# EAGLE design CM4-Interposer (EAGLE 9.6.2)

## Sheet 1 of 2
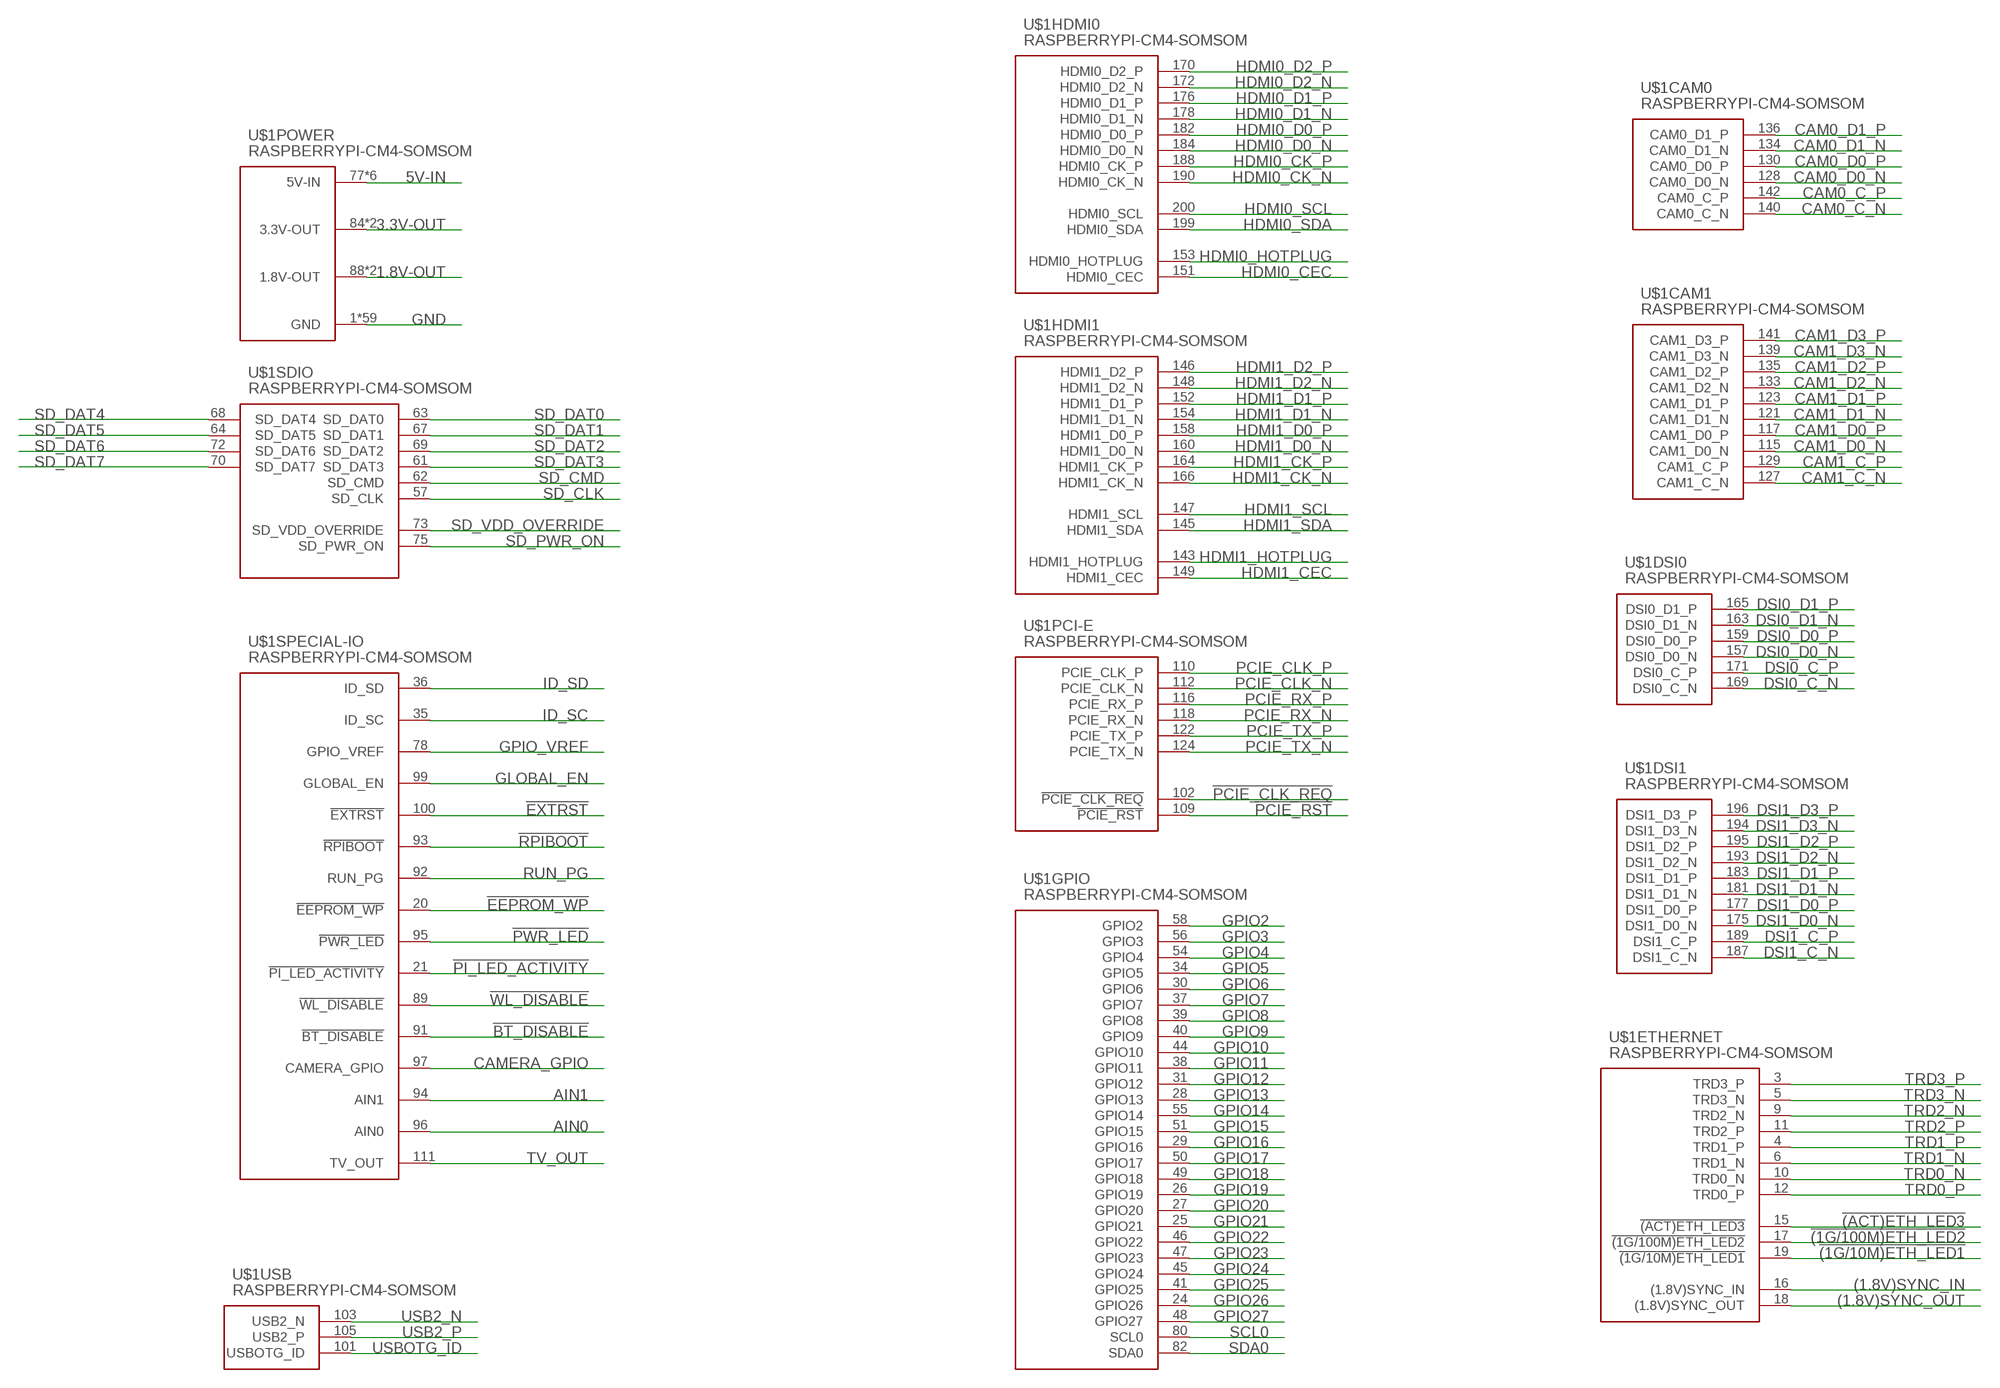
[diagram p0: schematic, sheet 1]

### Parts
U$1  RASPBERRYPI-CM4-SOMSOM  [RASPBERRYPI-CM4-PLUG]

### Nets
1.8V-OUT: U$1.88(POWER:1.8V-OUT) U$1.90(POWER:1.8V-OUT) ; also sheet 2
3.3V-OUT: U$1.84(POWER:3.3V-OUT) U$1.86(POWER:3.3V-OUT) ; also sheet 2
5V-IN: U$1.77(POWER:5V-IN) U$1.79(POWER:5V-IN) U$1.81(POWER:5V-IN) U$1.83(POWER:5V-IN) U$1.85(POWER:5V-IN) U$1.87(POWER:5V-IN) ; also sheet 2
!(1G/10M)ETH_LED1: U$1.19(ETHERNET:!(1G/10M)ETH_LED1) ; also sheet 2
!(1G/100M)ETH_LED2: U$1.17(ETHERNET:!(1G/100M)ETH_LED2) ; also sheet 2
!(ACT)ETH_LED3: U$1.15(ETHERNET:!(ACT)ETH_LED3) ; also sheet 2
!BT_DISABLE: U$1.91(SPECIAL-IO:!BT_DISABLE) ; also sheet 2
!EEPROM_WP: U$1.20(SPECIAL-IO:!EEPROM_WP) ; also sheet 2
!EXTRST: U$1.100(SPECIAL-IO:!EXTRST) ; also sheet 2
!PCIE_CLK_REQ: U$1.102(PCI-E:!PCIE_CLK_REQ) ; also sheet 2
!PCIE_RST: U$1.109(PCI-E:!PCIE_RST) ; also sheet 2
!PI_LED_ACTIVITY: U$1.21(SPECIAL-IO:!PI_LED_ACTIVITY) ; also sheet 2
!PWR_LED: U$1.95(SPECIAL-IO:!PWR_LED) ; also sheet 2
!RPIBOOT: U$1.93(SPECIAL-IO:!RPIBOOT) ; also sheet 2
!WL_DISABLE: U$1.89(SPECIAL-IO:!WL_DISABLE) ; also sheet 2
(1.8V)SYNC_IN: U$1.16(ETHERNET:(1.8V)SYNC_IN) ; also sheet 2
(1.8V)SYNC_OUT: U$1.18(ETHERNET:(1.8V)SYNC_OUT) ; also sheet 2
AIN0: U$1.96(SPECIAL-IO:AIN0) ; also sheet 2
AIN1: U$1.94(SPECIAL-IO:AIN1) ; also sheet 2
CAM0_C_N: U$1.140(CAM0:CAM0_C_N) ; also sheet 2
CAM0_C_P: U$1.142(CAM0:CAM0_C_P) ; also sheet 2
CAM0_D0_N: U$1.128(CAM0:CAM0_D0_N) ; also sheet 2
CAM0_D0_P: U$1.130(CAM0:CAM0_D0_P) ; also sheet 2
CAM0_D1_N: U$1.134(CAM0:CAM0_D1_N) ; also sheet 2
CAM0_D1_P: U$1.136(CAM0:CAM0_D1_P) ; also sheet 2
CAM1_C_N: U$1.127(CAM1:CAM1_C_N) ; also sheet 2
CAM1_C_P: U$1.129(CAM1:CAM1_C_P) ; also sheet 2
CAM1_D0_N: U$1.115(CAM1:CAM1_D0_N) ; also sheet 2
CAM1_D0_P: U$1.117(CAM1:CAM1_D0_P) ; also sheet 2
CAM1_D1_N: U$1.121(CAM1:CAM1_D1_N) ; also sheet 2
CAM1_D1_P: U$1.123(CAM1:CAM1_D1_P) ; also sheet 2
CAM1_D2_N: U$1.133(CAM1:CAM1_D2_N) ; also sheet 2
CAM1_D2_P: U$1.135(CAM1:CAM1_D2_P) ; also sheet 2
CAM1_D3_N: U$1.139(CAM1:CAM1_D3_N) ; also sheet 2
CAM1_D3_P: U$1.141(CAM1:CAM1_D3_P) ; also sheet 2
CAMERA_GPIO: U$1.97(SPECIAL-IO:CAMERA_GPIO) ; also sheet 2
DSI0_C_N: U$1.169(DSI0:DSI0_C_N) ; also sheet 2
DSI0_C_P: U$1.171(DSI0:DSI0_C_P) ; also sheet 2
DSI0_D0_N: U$1.157(DSI0:DSI0_D0_N) ; also sheet 2
DSI0_D0_P: U$1.159(DSI0:DSI0_D0_P) ; also sheet 2
DSI0_D1_N: U$1.163(DSI0:DSI0_D1_N) ; also sheet 2
DSI0_D1_P: U$1.165(DSI0:DSI0_D1_P) ; also sheet 2
DSI1_C_N: U$1.187(DSI1:DSI1_C_N) ; also sheet 2
DSI1_C_P: U$1.189(DSI1:DSI1_C_P) ; also sheet 2
DSI1_D0_N: U$1.175(DSI1:DSI1_D0_N) ; also sheet 2
DSI1_D0_P: U$1.177(DSI1:DSI1_D0_P) ; also sheet 2
DSI1_D1_N: U$1.181(DSI1:DSI1_D1_N) ; also sheet 2
DSI1_D1_P: U$1.183(DSI1:DSI1_D1_P) ; also sheet 2
DSI1_D2_N: U$1.193(DSI1:DSI1_D2_N) ; also sheet 2
DSI1_D2_P: U$1.195(DSI1:DSI1_D2_P) ; also sheet 2
DSI1_D3_N: U$1.194(DSI1:DSI1_D3_N) ; also sheet 2
DSI1_D3_P: U$1.196(DSI1:DSI1_D3_P) ; also sheet 2
GLOBAL_EN: U$1.99(SPECIAL-IO:GLOBAL_EN) ; also sheet 2
GND: U$1.1(POWER:GND) U$1.2(POWER:GND) U$1.7(POWER:GND) U$1.8(POWER:GND) U$1.13(POWER:GND) U$1.14(POWER:GND) U$1.22(POWER:GND) U$1.23(POWER:GND) U$1.32(POWER:GND) U$1.33(POWER:GND) U$1.42(POWER:GND) U$1.43(POWER:GND) U$1.52(POWER:GND) U$1.53(POWER:GND) U$1.59(POWER:GND) U$1.60(POWER:GND) U$1.65(POWER:GND) U$1.66(POWER:GND) U$1.71(POWER:GND) U$1.74(POWER:GND) U$1.98(POWER:GND) U$1.107(POWER:GND) U$1.108(POWER:GND) U$1.113(POWER:GND) U$1.114(POWER:GND) U$1.119(POWER:GND) U$1.120(POWER:GND) U$1.125(POWER:GND) U$1.126(POWER:GND) U$1.131(POWER:GND) U$1.132(POWER:GND) U$1.137(POWER:GND) U$1.138(POWER:GND) U$1.144(POWER:GND) U$1.150(POWER:GND) U$1.155(POWER:GND) U$1.156(POWER:GND) U$1.161(POWER:GND) U$1.162(POWER:GND) U$1.167(POWER:GND) U$1.168(POWER:GND) U$1.173(POWER:GND) U$1.174(POWER:GND) U$1.179(POWER:GND) U$1.180(POWER:GND) U$1.185(POWER:GND) U$1.186(POWER:GND) U$1.191(POWER:GND) U$1.192(POWER:GND) U$1.197(POWER:GND) U$1.198(POWER:GND) U$1.201(POWER:GND) U$1.202(POWER:GND) U$1.203(POWER:GND) U$1.204(POWER:GND) U$1.205(POWER:GND) U$1.206(POWER:GND) U$1.207(POWER:GND) U$1.208(POWER:GND) ; also sheet 2
GPIO2: U$1.58(GPIO:GPIO2) ; also sheet 2
GPIO3: U$1.56(GPIO:GPIO3) ; also sheet 2
GPIO4: U$1.54(GPIO:GPIO4) ; also sheet 2
GPIO5: U$1.34(GPIO:GPIO5) ; also sheet 2
GPIO6: U$1.30(GPIO:GPIO6) ; also sheet 2
GPIO7: U$1.37(GPIO:GPIO7) ; also sheet 2
GPIO8: U$1.39(GPIO:GPIO8) ; also sheet 2
GPIO9: U$1.40(GPIO:GPIO9) ; also sheet 2
GPIO10: U$1.44(GPIO:GPIO10) ; also sheet 2
GPIO11: U$1.38(GPIO:GPIO11) ; also sheet 2
GPIO12: U$1.31(GPIO:GPIO12) ; also sheet 2
GPIO13: U$1.28(GPIO:GPIO13) ; also sheet 2
GPIO14: U$1.55(GPIO:GPIO14) ; also sheet 2
GPIO15: U$1.51(GPIO:GPIO15) ; also sheet 2
GPIO16: U$1.29(GPIO:GPIO16) ; also sheet 2
GPIO17: U$1.50(GPIO:GPIO17) ; also sheet 2
GPIO18: U$1.49(GPIO:GPIO18) ; also sheet 2
GPIO19: U$1.26(GPIO:GPIO19) ; also sheet 2
GPIO20: U$1.27(GPIO:GPIO20) ; also sheet 2
GPIO21: U$1.25(GPIO:GPIO21) ; also sheet 2
GPIO22: U$1.46(GPIO:GPIO22) ; also sheet 2
GPIO23: U$1.47(GPIO:GPIO23) ; also sheet 2
GPIO24: U$1.45(GPIO:GPIO24) ; also sheet 2
GPIO25: U$1.41(GPIO:GPIO25) ; also sheet 2
GPIO26: U$1.24(GPIO:GPIO26) ; also sheet 2
GPIO27: U$1.48(GPIO:GPIO27) ; also sheet 2
GPIO_VREF: U$1.78(SPECIAL-IO:GPIO_VREF) ; also sheet 2
HDMI0_CEC: U$1.151(HDMI0:HDMI0_CEC) ; also sheet 2
HDMI0_CK_N: U$1.190(HDMI0:HDMI0_CK_N) ; also sheet 2
HDMI0_CK_P: U$1.188(HDMI0:HDMI0_CK_P) ; also sheet 2
HDMI0_D0_N: U$1.184(HDMI0:HDMI0_D0_N) ; also sheet 2
HDMI0_D0_P: U$1.182(HDMI0:HDMI0_D0_P) ; also sheet 2
HDMI0_D1_N: U$1.178(HDMI0:HDMI0_D1_N) ; also sheet 2
HDMI0_D1_P: U$1.176(HDMI0:HDMI0_D1_P) ; also sheet 2
HDMI0_D2_N: U$1.172(HDMI0:HDMI0_D2_N) ; also sheet 2
HDMI0_D2_P: U$1.170(HDMI0:HDMI0_D2_P) ; also sheet 2
HDMI0_HOTPLUG: U$1.153(HDMI0:HDMI0_HOTPLUG) ; also sheet 2
HDMI0_SCL: U$1.200(HDMI0:HDMI0_SCL) ; also sheet 2
HDMI0_SDA: U$1.199(HDMI0:HDMI0_SDA) ; also sheet 2
HDMI1_CEC: U$1.149(HDMI1:HDMI1_CEC) ; also sheet 2
HDMI1_CK_N: U$1.166(HDMI1:HDMI1_CK_N) ; also sheet 2
HDMI1_CK_P: U$1.164(HDMI1:HDMI1_CK_P) ; also sheet 2
HDMI1_D0_N: U$1.160(HDMI1:HDMI1_D0_N) ; also sheet 2
HDMI1_D0_P: U$1.158(HDMI1:HDMI1_D0_P) ; also sheet 2
HDMI1_D1_N: U$1.154(HDMI1:HDMI1_D1_N) ; also sheet 2
HDMI1_D1_P: U$1.152(HDMI1:HDMI1_D1_P) ; also sheet 2
HDMI1_D2_N: U$1.148(HDMI1:HDMI1_D2_N) ; also sheet 2
HDMI1_D2_P: U$1.146(HDMI1:HDMI1_D2_P) ; also sheet 2
HDMI1_HOTPLUG: U$1.143(HDMI1:HDMI1_HOTPLUG) ; also sheet 2
HDMI1_SCL: U$1.147(HDMI1:HDMI1_SCL) ; also sheet 2
HDMI1_SDA: U$1.145(HDMI1:HDMI1_SDA) ; also sheet 2
ID_SC: U$1.35(SPECIAL-IO:ID_SC) ; also sheet 2
ID_SD: U$1.36(SPECIAL-IO:ID_SD) ; also sheet 2
PCIE_CLK_N: U$1.112(PCI-E:PCIE_CLK_N) ; also sheet 2
PCIE_CLK_P: U$1.110(PCI-E:PCIE_CLK_P) ; also sheet 2
PCIE_RX_N: U$1.118(PCI-E:PCIE_RX_N) ; also sheet 2
PCIE_RX_P: U$1.116(PCI-E:PCIE_RX_P) ; also sheet 2
PCIE_TX_N: U$1.124(PCI-E:PCIE_TX_N) ; also sheet 2
PCIE_TX_P: U$1.122(PCI-E:PCIE_TX_P) ; also sheet 2
RUN_PG: U$1.92(SPECIAL-IO:RUN_PG) ; also sheet 2
SCL0: U$1.80(GPIO:SCL0) ; also sheet 2
SD_CLK: U$1.57(SDIO:SD_CLK) ; also sheet 2
SD_CMD: U$1.62(SDIO:SD_CMD) ; also sheet 2
SD_DAT0: U$1.63(SDIO:SD_DAT0) ; also sheet 2
SD_DAT1: U$1.67(SDIO:SD_DAT1) ; also sheet 2
SD_DAT2: U$1.69(SDIO:SD_DAT2) ; also sheet 2
SD_DAT3: U$1.61(SDIO:SD_DAT3) ; also sheet 2
SD_DAT4: U$1.68(SDIO:SD_DAT4) ; also sheet 2
SD_DAT5: U$1.64(SDIO:SD_DAT5) ; also sheet 2
SD_DAT6: U$1.72(SDIO:SD_DAT6) ; also sheet 2
SD_DAT7: U$1.70(SDIO:SD_DAT7) ; also sheet 2
SD_PWR_ON: U$1.75(SDIO:SD_PWR_ON) ; also sheet 2
SD_VDD_OVERRIDE: U$1.73(SDIO:SD_VDD_OVERRIDE) ; also sheet 2
SDA0: U$1.82(GPIO:SDA0) ; also sheet 2
TRD0_N: U$1.10(ETHERNET:TRD0_N) ; also sheet 2
TRD0_P: U$1.12(ETHERNET:TRD0_P) ; also sheet 2
TRD1_N: U$1.6(ETHERNET:TRD1_N) ; also sheet 2
TRD1_P: U$1.4(ETHERNET:TRD1_P) ; also sheet 2
TRD2_N: U$1.9(ETHERNET:TRD2_N) ; also sheet 2
TRD2_P: U$1.11(ETHERNET:TRD2_P) ; also sheet 2
TRD3_N: U$1.5(ETHERNET:TRD3_N) ; also sheet 2
TRD3_P: U$1.3(ETHERNET:TRD3_P) ; also sheet 2
TV_OUT: U$1.111(SPECIAL-IO:TV_OUT) ; also sheet 2
USB2_N: U$1.103(USB:USB2_N) ; also sheet 2
USB2_P: U$1.105(USB:USB2_P) ; also sheet 2
USBOTG_ID: U$1.101(USB:USBOTG_ID) ; also sheet 2

## Sheet 2 of 2
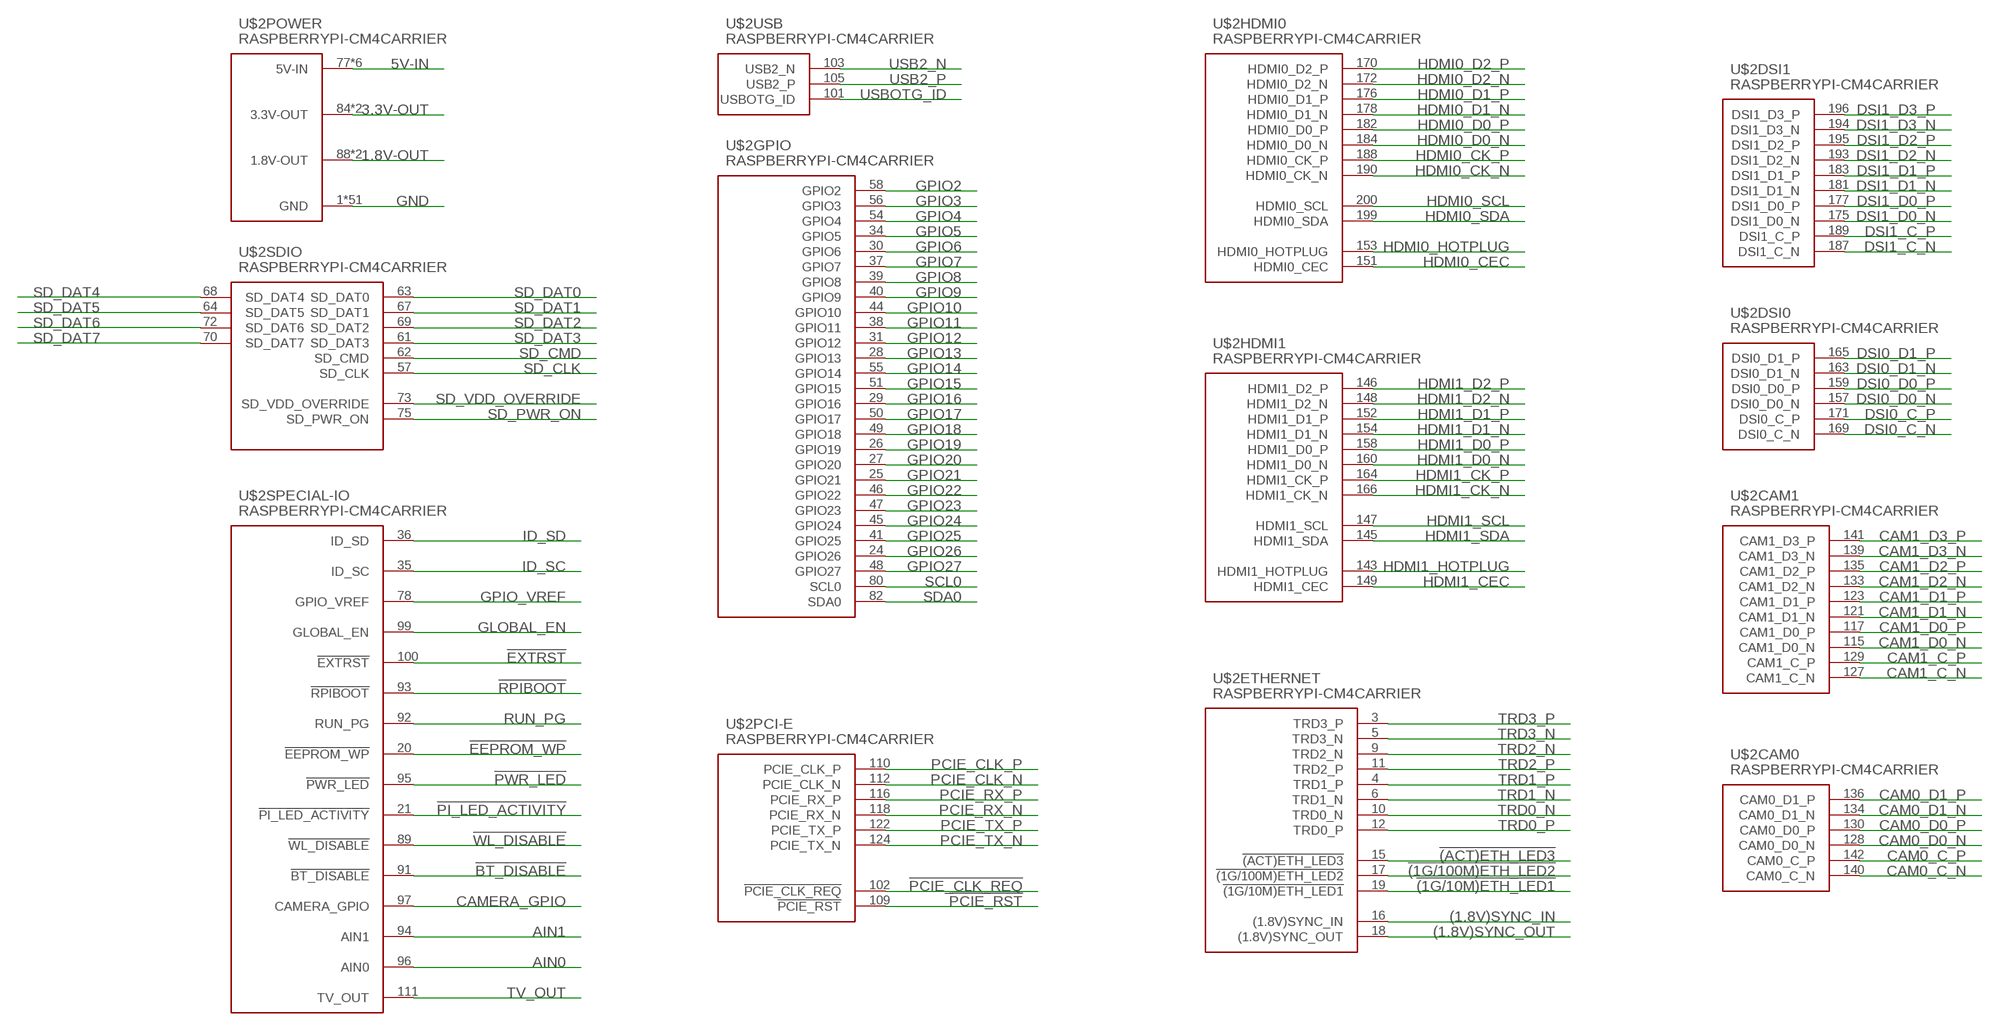
[diagram p1: schematic, sheet 2]

### Parts
U$2  RASPBERRYPI-CM4CARRIER  [RASPBERRYPI-CM4]

### Nets
1.8V-OUT: U$2.88(POWER:1.8V-OUT) U$2.90(POWER:1.8V-OUT) ; also sheet 1
3.3V-OUT: U$2.84(POWER:3.3V-OUT) U$2.86(POWER:3.3V-OUT) ; also sheet 1
5V-IN: U$2.77(POWER:5V-IN) U$2.79(POWER:5V-IN) U$2.81(POWER:5V-IN) U$2.83(POWER:5V-IN) U$2.85(POWER:5V-IN) U$2.87(POWER:5V-IN) ; also sheet 1
!(1G/10M)ETH_LED1: U$2.19(ETHERNET:!(1G/10M)ETH_LED1) ; also sheet 1
!(1G/100M)ETH_LED2: U$2.17(ETHERNET:!(1G/100M)ETH_LED2) ; also sheet 1
!(ACT)ETH_LED3: U$2.15(ETHERNET:!(ACT)ETH_LED3) ; also sheet 1
!BT_DISABLE: U$2.91(SPECIAL-IO:!BT_DISABLE) ; also sheet 1
!EEPROM_WP: U$2.20(SPECIAL-IO:!EEPROM_WP) ; also sheet 1
!EXTRST: U$2.100(SPECIAL-IO:!EXTRST) ; also sheet 1
!PCIE_CLK_REQ: U$2.102(PCI-E:!PCIE_CLK_REQ) ; also sheet 1
!PCIE_RST: U$2.109(PCI-E:!PCIE_RST) ; also sheet 1
!PI_LED_ACTIVITY: U$2.21(SPECIAL-IO:!PI_LED_ACTIVITY) ; also sheet 1
!PWR_LED: U$2.95(SPECIAL-IO:!PWR_LED) ; also sheet 1
!RPIBOOT: U$2.93(SPECIAL-IO:!RPIBOOT) ; also sheet 1
!WL_DISABLE: U$2.89(SPECIAL-IO:!WL_DISABLE) ; also sheet 1
(1.8V)SYNC_IN: U$2.16(ETHERNET:(1.8V)SYNC_IN) ; also sheet 1
(1.8V)SYNC_OUT: U$2.18(ETHERNET:(1.8V)SYNC_OUT) ; also sheet 1
AIN0: U$2.96(SPECIAL-IO:AIN0) ; also sheet 1
AIN1: U$2.94(SPECIAL-IO:AIN1) ; also sheet 1
CAM0_C_N: U$2.140(CAM0:CAM0_C_N) ; also sheet 1
CAM0_C_P: U$2.142(CAM0:CAM0_C_P) ; also sheet 1
CAM0_D0_N: U$2.128(CAM0:CAM0_D0_N) ; also sheet 1
CAM0_D0_P: U$2.130(CAM0:CAM0_D0_P) ; also sheet 1
CAM0_D1_N: U$2.134(CAM0:CAM0_D1_N) ; also sheet 1
CAM0_D1_P: U$2.136(CAM0:CAM0_D1_P) ; also sheet 1
CAM1_C_N: U$2.127(CAM1:CAM1_C_N) ; also sheet 1
CAM1_C_P: U$2.129(CAM1:CAM1_C_P) ; also sheet 1
CAM1_D0_N: U$2.115(CAM1:CAM1_D0_N) ; also sheet 1
CAM1_D0_P: U$2.117(CAM1:CAM1_D0_P) ; also sheet 1
CAM1_D1_N: U$2.121(CAM1:CAM1_D1_N) ; also sheet 1
CAM1_D1_P: U$2.123(CAM1:CAM1_D1_P) ; also sheet 1
CAM1_D2_N: U$2.133(CAM1:CAM1_D2_N) ; also sheet 1
CAM1_D2_P: U$2.135(CAM1:CAM1_D2_P) ; also sheet 1
CAM1_D3_N: U$2.139(CAM1:CAM1_D3_N) ; also sheet 1
CAM1_D3_P: U$2.141(CAM1:CAM1_D3_P) ; also sheet 1
CAMERA_GPIO: U$2.97(SPECIAL-IO:CAMERA_GPIO) ; also sheet 1
DSI0_C_N: U$2.169(DSI0:DSI0_C_N) ; also sheet 1
DSI0_C_P: U$2.171(DSI0:DSI0_C_P) ; also sheet 1
DSI0_D0_N: U$2.157(DSI0:DSI0_D0_N) ; also sheet 1
DSI0_D0_P: U$2.159(DSI0:DSI0_D0_P) ; also sheet 1
DSI0_D1_N: U$2.163(DSI0:DSI0_D1_N) ; also sheet 1
DSI0_D1_P: U$2.165(DSI0:DSI0_D1_P) ; also sheet 1
DSI1_C_N: U$2.187(DSI1:DSI1_C_N) ; also sheet 1
DSI1_C_P: U$2.189(DSI1:DSI1_C_P) ; also sheet 1
DSI1_D0_N: U$2.175(DSI1:DSI1_D0_N) ; also sheet 1
DSI1_D0_P: U$2.177(DSI1:DSI1_D0_P) ; also sheet 1
DSI1_D1_N: U$2.181(DSI1:DSI1_D1_N) ; also sheet 1
DSI1_D1_P: U$2.183(DSI1:DSI1_D1_P) ; also sheet 1
DSI1_D2_N: U$2.193(DSI1:DSI1_D2_N) ; also sheet 1
DSI1_D2_P: U$2.195(DSI1:DSI1_D2_P) ; also sheet 1
DSI1_D3_N: U$2.194(DSI1:DSI1_D3_N) ; also sheet 1
DSI1_D3_P: U$2.196(DSI1:DSI1_D3_P) ; also sheet 1
GLOBAL_EN: U$2.99(SPECIAL-IO:GLOBAL_EN) ; also sheet 1
GND: U$2.1(POWER:GND) U$2.2(POWER:GND) U$2.7(POWER:GND) U$2.8(POWER:GND) U$2.13(POWER:GND) U$2.14(POWER:GND) U$2.22(POWER:GND) U$2.23(POWER:GND) U$2.32(POWER:GND) U$2.33(POWER:GND) U$2.42(POWER:GND) U$2.43(POWER:GND) U$2.52(POWER:GND) U$2.53(POWER:GND) U$2.59(POWER:GND) U$2.60(POWER:GND) U$2.65(POWER:GND) U$2.66(POWER:GND) U$2.71(POWER:GND) U$2.74(POWER:GND) U$2.98(POWER:GND) U$2.107(POWER:GND) U$2.108(POWER:GND) U$2.113(POWER:GND) U$2.114(POWER:GND) U$2.119(POWER:GND) U$2.120(POWER:GND) U$2.125(POWER:GND) U$2.126(POWER:GND) U$2.131(POWER:GND) U$2.132(POWER:GND) U$2.137(POWER:GND) U$2.138(POWER:GND) U$2.144(POWER:GND) U$2.150(POWER:GND) U$2.155(POWER:GND) U$2.156(POWER:GND) U$2.161(POWER:GND) U$2.162(POWER:GND) U$2.167(POWER:GND) U$2.168(POWER:GND) U$2.173(POWER:GND) U$2.174(POWER:GND) U$2.179(POWER:GND) U$2.180(POWER:GND) U$2.185(POWER:GND) U$2.186(POWER:GND) U$2.191(POWER:GND) U$2.192(POWER:GND) U$2.197(POWER:GND) U$2.198(POWER:GND) ; also sheet 1
GPIO2: U$2.58(GPIO:GPIO2) ; also sheet 1
GPIO3: U$2.56(GPIO:GPIO3) ; also sheet 1
GPIO4: U$2.54(GPIO:GPIO4) ; also sheet 1
GPIO5: U$2.34(GPIO:GPIO5) ; also sheet 1
GPIO6: U$2.30(GPIO:GPIO6) ; also sheet 1
GPIO7: U$2.37(GPIO:GPIO7) ; also sheet 1
GPIO8: U$2.39(GPIO:GPIO8) ; also sheet 1
GPIO9: U$2.40(GPIO:GPIO9) ; also sheet 1
GPIO10: U$2.44(GPIO:GPIO10) ; also sheet 1
GPIO11: U$2.38(GPIO:GPIO11) ; also sheet 1
GPIO12: U$2.31(GPIO:GPIO12) ; also sheet 1
GPIO13: U$2.28(GPIO:GPIO13) ; also sheet 1
GPIO14: U$2.55(GPIO:GPIO14) ; also sheet 1
GPIO15: U$2.51(GPIO:GPIO15) ; also sheet 1
GPIO16: U$2.29(GPIO:GPIO16) ; also sheet 1
GPIO17: U$2.50(GPIO:GPIO17) ; also sheet 1
GPIO18: U$2.49(GPIO:GPIO18) ; also sheet 1
GPIO19: U$2.26(GPIO:GPIO19) ; also sheet 1
GPIO20: U$2.27(GPIO:GPIO20) ; also sheet 1
GPIO21: U$2.25(GPIO:GPIO21) ; also sheet 1
GPIO22: U$2.46(GPIO:GPIO22) ; also sheet 1
GPIO23: U$2.47(GPIO:GPIO23) ; also sheet 1
GPIO24: U$2.45(GPIO:GPIO24) ; also sheet 1
GPIO25: U$2.41(GPIO:GPIO25) ; also sheet 1
GPIO26: U$2.24(GPIO:GPIO26) ; also sheet 1
GPIO27: U$2.48(GPIO:GPIO27) ; also sheet 1
GPIO_VREF: U$2.78(SPECIAL-IO:GPIO_VREF) ; also sheet 1
HDMI0_CEC: U$2.151(HDMI0:HDMI0_CEC) ; also sheet 1
HDMI0_CK_N: U$2.190(HDMI0:HDMI0_CK_N) ; also sheet 1
HDMI0_CK_P: U$2.188(HDMI0:HDMI0_CK_P) ; also sheet 1
HDMI0_D0_N: U$2.184(HDMI0:HDMI0_D0_N) ; also sheet 1
HDMI0_D0_P: U$2.182(HDMI0:HDMI0_D0_P) ; also sheet 1
HDMI0_D1_N: U$2.178(HDMI0:HDMI0_D1_N) ; also sheet 1
HDMI0_D1_P: U$2.176(HDMI0:HDMI0_D1_P) ; also sheet 1
HDMI0_D2_N: U$2.172(HDMI0:HDMI0_D2_N) ; also sheet 1
HDMI0_D2_P: U$2.170(HDMI0:HDMI0_D2_P) ; also sheet 1
HDMI0_HOTPLUG: U$2.153(HDMI0:HDMI0_HOTPLUG) ; also sheet 1
HDMI0_SCL: U$2.200(HDMI0:HDMI0_SCL) ; also sheet 1
HDMI0_SDA: U$2.199(HDMI0:HDMI0_SDA) ; also sheet 1
HDMI1_CEC: U$2.149(HDMI1:HDMI1_CEC) ; also sheet 1
HDMI1_CK_N: U$2.166(HDMI1:HDMI1_CK_N) ; also sheet 1
HDMI1_CK_P: U$2.164(HDMI1:HDMI1_CK_P) ; also sheet 1
HDMI1_D0_N: U$2.160(HDMI1:HDMI1_D0_N) ; also sheet 1
HDMI1_D0_P: U$2.158(HDMI1:HDMI1_D0_P) ; also sheet 1
HDMI1_D1_N: U$2.154(HDMI1:HDMI1_D1_N) ; also sheet 1
HDMI1_D1_P: U$2.152(HDMI1:HDMI1_D1_P) ; also sheet 1
HDMI1_D2_N: U$2.148(HDMI1:HDMI1_D2_N) ; also sheet 1
HDMI1_D2_P: U$2.146(HDMI1:HDMI1_D2_P) ; also sheet 1
HDMI1_HOTPLUG: U$2.143(HDMI1:HDMI1_HOTPLUG) ; also sheet 1
HDMI1_SCL: U$2.147(HDMI1:HDMI1_SCL) ; also sheet 1
HDMI1_SDA: U$2.145(HDMI1:HDMI1_SDA) ; also sheet 1
ID_SC: U$2.35(SPECIAL-IO:ID_SC) ; also sheet 1
ID_SD: U$2.36(SPECIAL-IO:ID_SD) ; also sheet 1
PCIE_CLK_N: U$2.112(PCI-E:PCIE_CLK_N) ; also sheet 1
PCIE_CLK_P: U$2.110(PCI-E:PCIE_CLK_P) ; also sheet 1
PCIE_RX_N: U$2.118(PCI-E:PCIE_RX_N) ; also sheet 1
PCIE_RX_P: U$2.116(PCI-E:PCIE_RX_P) ; also sheet 1
PCIE_TX_N: U$2.124(PCI-E:PCIE_TX_N) ; also sheet 1
PCIE_TX_P: U$2.122(PCI-E:PCIE_TX_P) ; also sheet 1
RUN_PG: U$2.92(SPECIAL-IO:RUN_PG) ; also sheet 1
SCL0: U$2.80(GPIO:SCL0) ; also sheet 1
SD_CLK: U$2.57(SDIO:SD_CLK) ; also sheet 1
SD_CMD: U$2.62(SDIO:SD_CMD) ; also sheet 1
SD_DAT0: U$2.63(SDIO:SD_DAT0) ; also sheet 1
SD_DAT1: U$2.67(SDIO:SD_DAT1) ; also sheet 1
SD_DAT2: U$2.69(SDIO:SD_DAT2) ; also sheet 1
SD_DAT3: U$2.61(SDIO:SD_DAT3) ; also sheet 1
SD_DAT4: U$2.68(SDIO:SD_DAT4) ; also sheet 1
SD_DAT5: U$2.64(SDIO:SD_DAT5) ; also sheet 1
SD_DAT6: U$2.72(SDIO:SD_DAT6) ; also sheet 1
SD_DAT7: U$2.70(SDIO:SD_DAT7) ; also sheet 1
SD_PWR_ON: U$2.75(SDIO:SD_PWR_ON) ; also sheet 1
SD_VDD_OVERRIDE: U$2.73(SDIO:SD_VDD_OVERRIDE) ; also sheet 1
SDA0: U$2.82(GPIO:SDA0) ; also sheet 1
TRD0_N: U$2.10(ETHERNET:TRD0_N) ; also sheet 1
TRD0_P: U$2.12(ETHERNET:TRD0_P) ; also sheet 1
TRD1_N: U$2.6(ETHERNET:TRD1_N) ; also sheet 1
TRD1_P: U$2.4(ETHERNET:TRD1_P) ; also sheet 1
TRD2_N: U$2.9(ETHERNET:TRD2_N) ; also sheet 1
TRD2_P: U$2.11(ETHERNET:TRD2_P) ; also sheet 1
TRD3_N: U$2.5(ETHERNET:TRD3_N) ; also sheet 1
TRD3_P: U$2.3(ETHERNET:TRD3_P) ; also sheet 1
TV_OUT: U$2.111(SPECIAL-IO:TV_OUT) ; also sheet 1
USB2_N: U$2.103(USB:USB2_N) ; also sheet 1
USB2_P: U$2.105(USB:USB2_P) ; also sheet 1
USBOTG_ID: U$2.101(USB:USBOTG_ID) ; also sheet 1

## Library data of the parts
U$1 = Custom-Parts:RASPBERRYPI-CM4-SOM
U$2 = Custom-Parts:RASPBERRYPI-CM4

## Board
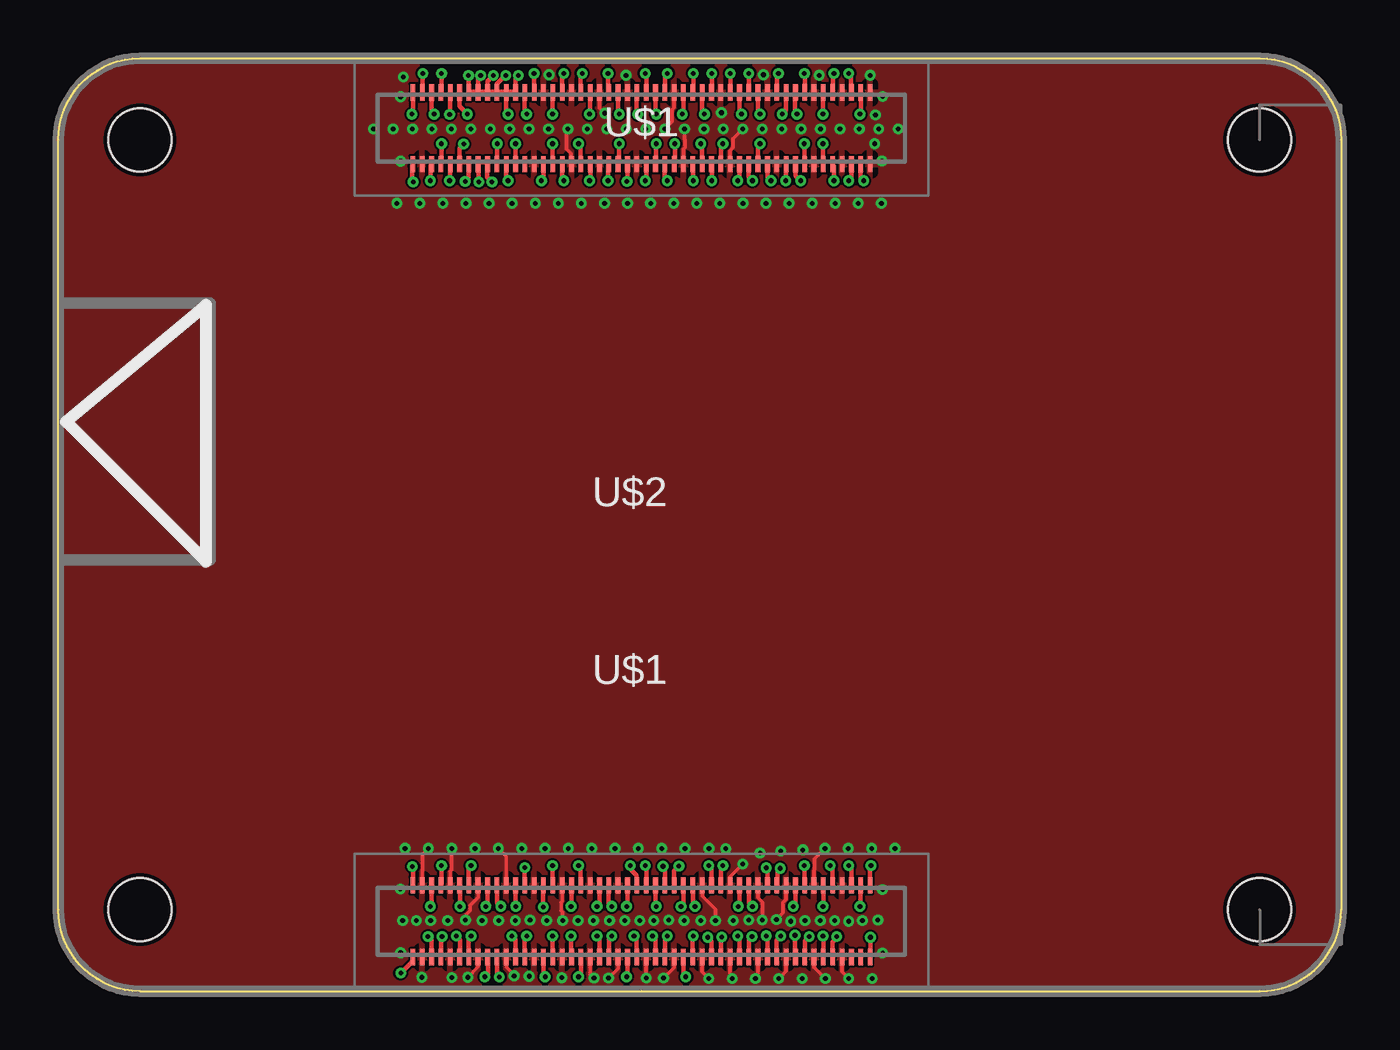
[diagram p2: board, top side]
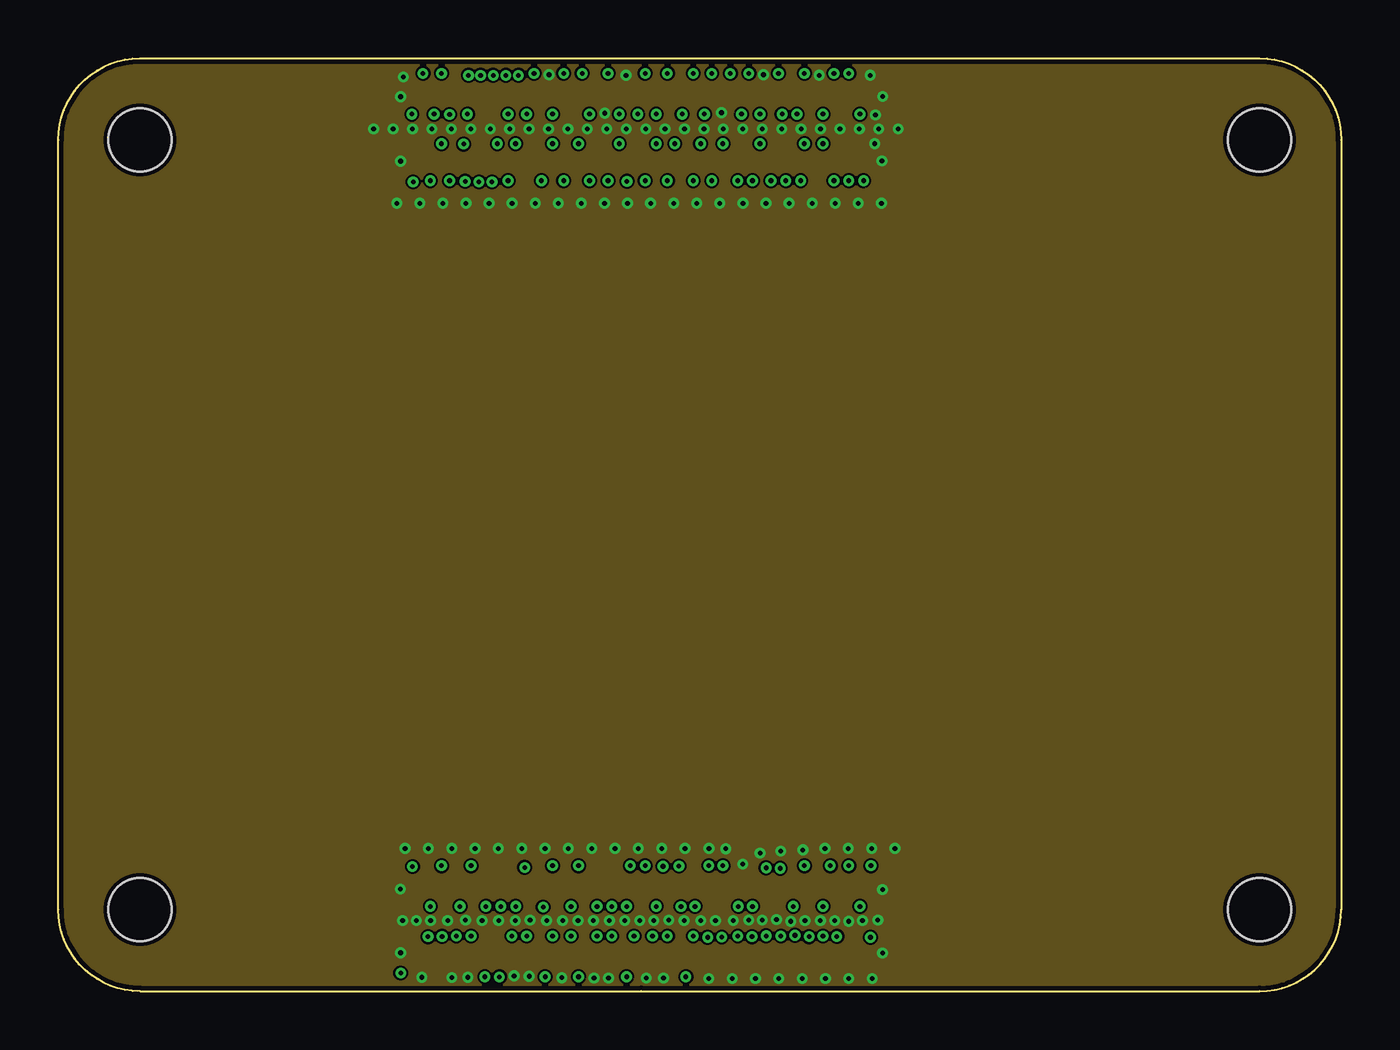
[diagram p3: board, inner layer Route2]
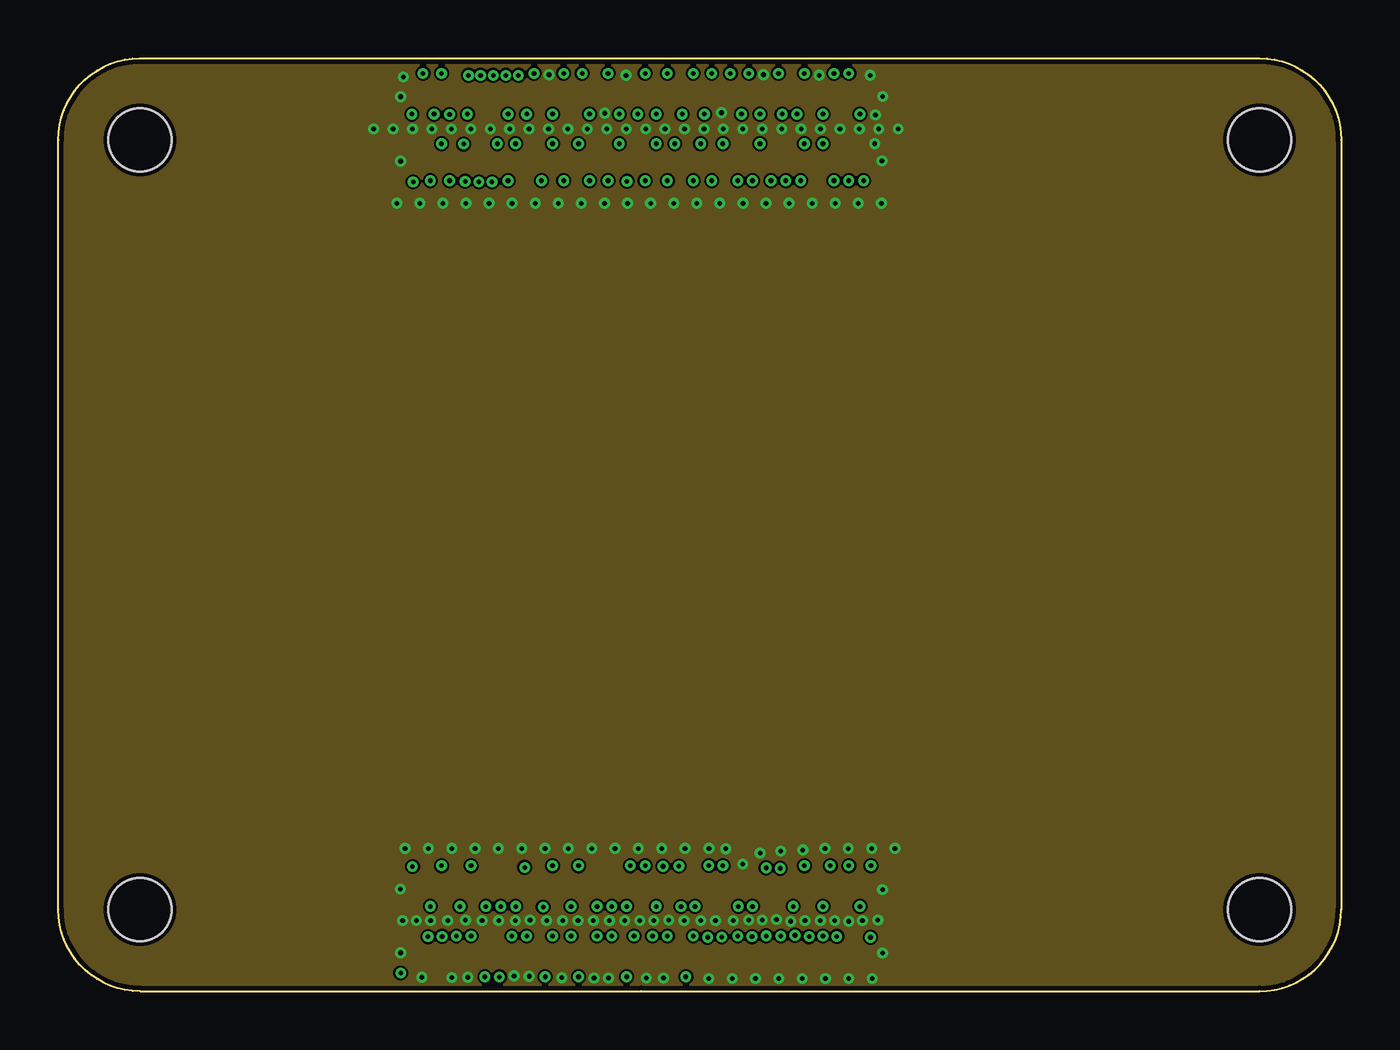
[diagram p4: board, inner layer Route15]
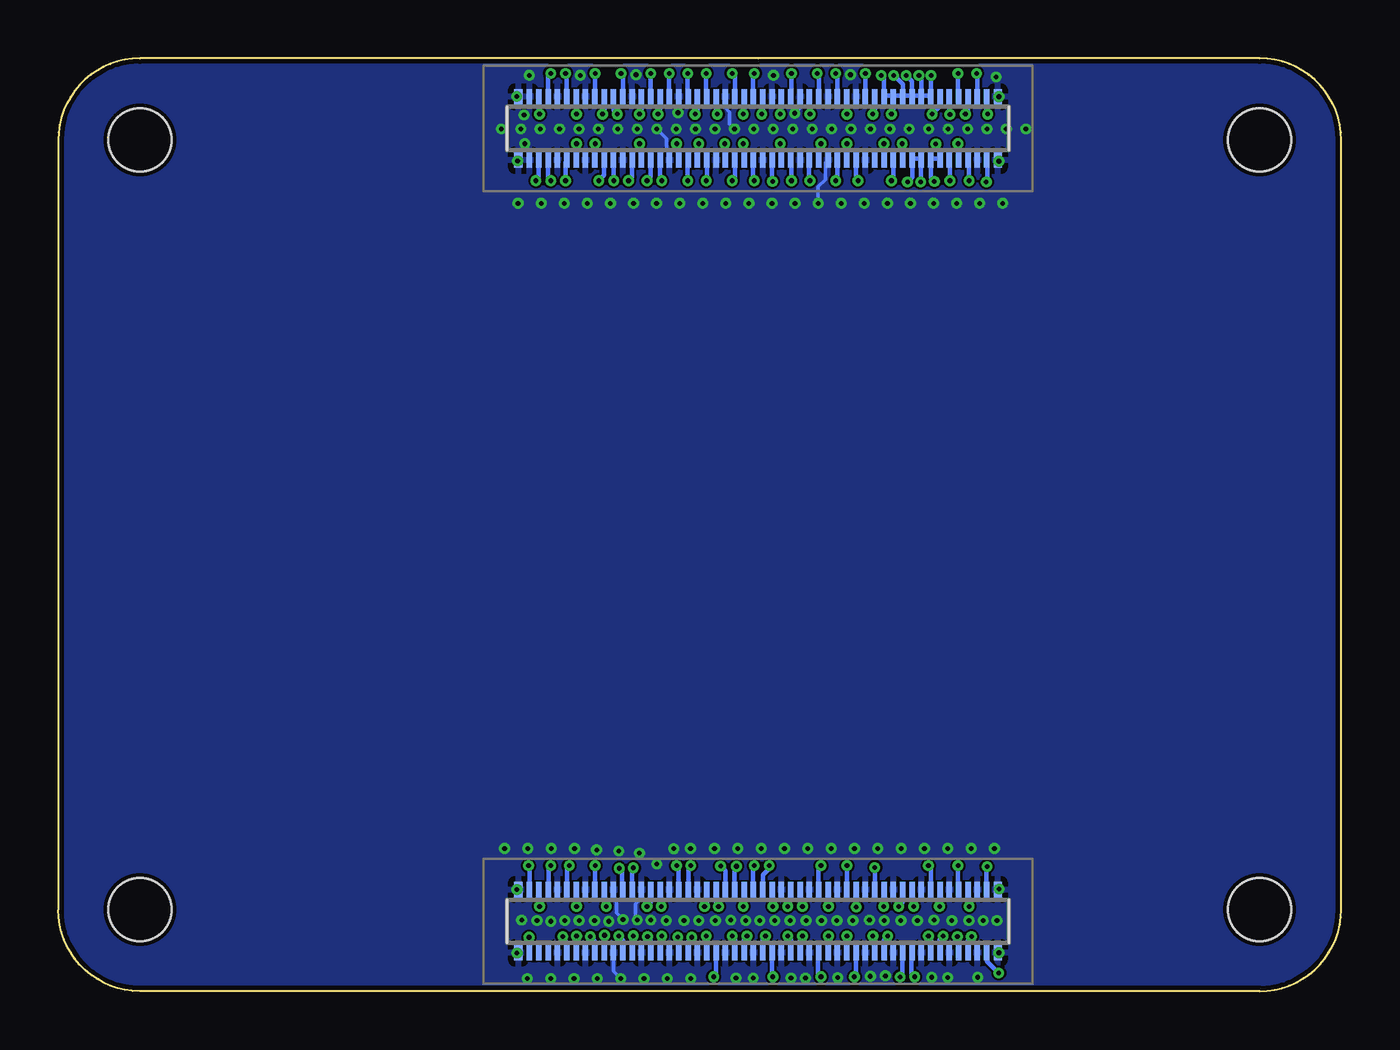
[diagram p5: board, bottom side, seen from below]

Size 55 x 40 mm. Coordinates in mm from the lower left corner, seen from the top.
Copper layers (1+2*15+16): Top 0.035mm / dielectric 0.2mm / Route2 0.0175mm / dielectric 1.065mm / Route15 0.0175mm / dielectric 0.2mm / Bottom 0.035mm
Design rules "DLT-4Layer-new-JLC-rules": minimum track width 4mil, minimum drill 0.2mm, track to track 3.5mil, track to pad 3.5mil, pad to pad 5mil, via to via 5mil, smd to smd 0mil, copper to edge 0.2mm, drill to drill 10mil, minimum pad ring 0.25mm, minimum via ring 0.13mm, stop-mask expansion 0.05mm, vias tented up to drill 100mil, thermal gap 10mil

### Footprints (pad centres in the part's own frame; a part is rotated, then mirrored left to right if it is on the bottom)
RASPBERRYPI-CM4-PLUG = smd 0.23 x 0.66 bottom: 1 9.8,35.345; 2 9.8,32.635; 3 9.4,35.345; 4 9.4,32.635; 5 9,35.345; 6 9,32.635; 7 8.6,35.345; 8 8.6,32.635; 9 8.2,35.345; 10 8.2,32.635; 11 7.8,35.345; 12 7.8,32.635; 13 7.4,35.345; 14 7.4,32.635; 15 7,35.345; 16 7,32.635; 17 6.6,35.345; 18 6.6,32.635; 19 6.2,35.345; 20 6.2,32.635; 21 5.8,35.345; 22 5.8,32.635; 23 5.4,35.345; 24 5.4,32.635; 25 5,35.345; 26 5,32.635; 27 4.6,35.345; 28 4.6,32.635; 29 4.2,35.345; 30 4.2,32.635; 31 3.8,35.345; 32 3.8,32.635; 33 3.4,35.345; 34 3.4,32.635; 35 3,35.345; 36 3,32.635; 37 2.6,35.345; 38 2.6,32.635; 39 2.2,35.345; 40 2.2,32.635; 41 1.8,35.345; 42 1.8,32.635; 43 1.4,35.345; 44 1.4,32.635; 45 1,35.345; 46 1,32.635; 47 0.6,35.345; 48 0.6,32.635; 49 0.2,35.345; 50 0.2,32.635; 51 -0.2,35.345; 52 -0.2,32.635; 53 -0.6,35.345; 54 -0.6,32.635; 55 -1,35.345; 56 -1,32.635; 57 -1.4,35.345; 58 -1.4,32.635; 59 -1.8,35.345; 60 -1.8,32.635; 61 -2.2,35.345; 62 -2.2,32.635; 63 -2.6,35.345; 64 -2.6,32.635; 65 -3,35.345; 66 -3,32.635; 67 -3.4,35.345; 68 -3.4,32.635; 69 -3.8,35.345; 70 -3.8,32.635; 71 -4.2,35.345; 72 -4.2,32.635; 73 -4.6,35.345; 74 -4.6,32.635; 75 -5,35.345; 76 -5,32.635; 77 -5.4,35.345; 78 -5.4,32.635; 79 -5.8,35.345; 80 -5.8,32.635; 81 -6.2,35.345; 82 -6.2,32.635; 83 -6.6,35.345; 84 -6.6,32.635; 85 -7,35.345; 86 -7,32.635; 87 -7.4,35.345; 88 -7.4,32.635; 89 -7.8,35.345; 90 -7.8,32.635; 91 -8.2,35.345; 92 -8.2,32.635; 93 -8.6,35.345; 94 -8.6,32.635; 95 -9,35.345; 96 -9,32.635; 97 -9.4,35.345; 98 -9.4,32.635; 99 -9.8,35.345; 100 -9.8,32.635; 101 9.8,1.355; 102 9.8,-1.355; 103 9.4,1.355; 104 9.4,-1.355; 105 9,1.355; 106 9,-1.355; 107 8.6,1.355; 108 8.6,-1.355; 109 8.2,1.355; 110 8.2,-1.355; 111 7.8,1.355; 112 7.8,-1.355; 113 7.4,1.355; 114 7.4,-1.355; 115 7,1.355; 116 7,-1.355; 117 6.6,1.355; 118 6.6,-1.355; 119 6.2,1.355; 120 6.2,-1.355; 121 5.8,1.355; 122 5.8,-1.355; 123 5.4,1.355; 124 5.4,-1.355; 125 5,1.355; 126 5,-1.355; 127 4.6,1.355; 128 4.6,-1.355; 129 4.2,1.355; 130 4.2,-1.355; 131 3.8,1.355; 132 3.8,-1.355; 133 3.4,1.355; 134 3.4,-1.355; 135 3,1.355; 136 3,-1.355; 137 2.6,1.355; 138 2.6,-1.355; 139 2.2,1.355; 140 2.2,-1.355; 141 1.8,1.355; 142 1.8,-1.355; 143 1.4,1.355; 144 1.4,-1.355; 145 1,1.355; 146 1,-1.355; 147 0.6,1.355; 148 0.6,-1.355; 149 0.2,1.355; 150 0.2,-1.355; 151 -0.2,1.355; 152 -0.2,-1.355; 153 -0.6,1.355; 154 -0.6,-1.355; 155 -1,1.355; 156 -1,-1.355; 157 -1.4,1.355; 158 -1.4,-1.355; 159 -1.8,1.355; 160 -1.8,-1.355; 161 -2.2,1.355; 162 -2.2,-1.355; 163 -2.6,1.355; 164 -2.6,-1.355; 165 -3,1.355; 166 -3,-1.355; 167 -3.4,1.355; 168 -3.4,-1.355; 169 -3.8,1.355; 170 -3.8,-1.355; 171 -4.2,1.355; 172 -4.2,-1.355; 173 -4.6,1.355; 174 -4.6,-1.355; 175 -5,1.355; 176 -5,-1.355; 177 -5.4,1.355; 178 -5.4,-1.355; 179 -5.8,1.355; 180 -5.8,-1.355; 181 -6.2,1.355; 182 -6.2,-1.355; 183 -6.6,1.355; 184 -6.6,-1.355; 185 -7,1.355; 186 -7,-1.355; 187 -7.4,1.355; 188 -7.4,-1.355; 189 -7.8,1.355; 190 -7.8,-1.355; 191 -8.2,1.355; 192 -8.2,-1.355; 193 -8.6,1.355; 194 -8.6,-1.355; 195 -9,1.355; 196 -9,-1.355; 197 -9.4,1.355; 198 -9.4,-1.355; 199 -9.8,1.355; 200 -9.8,-1.355 | smd 0.35 x 0.66 bottom: 201 10.275,-1.355; 202 10.275,1.355; 203 -10.275,1.355; 204 -10.275,-1.355; 205 10.275,32.635; 206 10.275,35.345; 207 -10.275,35.345; 208 -10.275,32.635 | hole 2.7: -21.5,33.5; 26.5,33.5; -21.5,0.5; 26.5,0.5
RASPBERRYPI-CM4 = smd 0.2 x 0.7: 1 9.8,35.54; 2 9.8,32.46; 3 9.4,35.54; 4 9.4,32.46; 5 9,35.54; 6 9,32.46; 7 8.6,35.54; 8 8.6,32.46; 9 8.2,35.54; 10 8.2,32.46; 11 7.8,35.54; 12 7.8,32.46; 13 7.4,35.54; 14 7.4,32.46; 15 7,35.54; 16 7,32.46; 17 6.6,35.54; 18 6.6,32.46; 19 6.2,35.54; 20 6.2,32.46; 21 5.8,35.54; 22 5.8,32.46; 23 5.4,35.54; 24 5.4,32.46; 25 5,35.54; 26 5,32.46; 27 4.6,35.54; 28 4.6,32.46; 29 4.2,35.54; 30 4.2,32.46; 31 3.8,35.54; 32 3.8,32.46; 33 3.4,35.54; 34 3.4,32.46; 35 3,35.54; 36 3,32.46; 37 2.6,35.54; 38 2.6,32.46; 39 2.2,35.54; 40 2.2,32.46; 41 1.8,35.54; 42 1.8,32.46; 43 1.4,35.54; 44 1.4,32.46; 45 1,35.54; 46 1,32.46; 47 0.6,35.54; 48 0.6,32.46; 49 0.2,35.54; 50 0.2,32.46; 51 -0.2,35.54; 52 -0.2,32.46; 53 -0.6,35.54; 54 -0.6,32.46; 55 -1,35.54; 56 -1,32.46; 57 -1.4,35.54; 58 -1.4,32.46; 59 -1.8,35.54; 60 -1.8,32.46; 61 -2.2,35.54; 62 -2.2,32.46; 63 -2.6,35.54; 64 -2.6,32.46; 65 -3,35.54; 66 -3,32.46; 67 -3.4,35.54; 68 -3.4,32.46; 69 -3.8,35.54; 70 -3.8,32.46; 71 -4.2,35.54; 72 -4.2,32.46; 73 -4.6,35.54; 74 -4.6,32.46; 75 -5,35.54; 76 -5,32.46; 77 -5.4,35.54; 78 -5.4,32.46; 79 -5.8,35.54; 80 -5.8,32.46; 81 -6.2,35.54; 82 -6.2,32.46; 83 -6.6,35.54; 84 -6.6,32.46; 85 -7,35.54; 86 -7,32.46; 87 -7.4,35.54; 88 -7.4,32.46; 89 -7.8,35.54; 90 -7.8,32.46; 91 -8.2,35.54; 92 -8.2,32.46; 93 -8.6,35.54; 94 -8.6,32.46; 95 -9,35.54; 96 -9,32.46; 97 -9.4,35.54; 98 -9.4,32.46; 99 -9.8,35.54; 100 -9.8,32.46; 101 9.8,1.54; 102 9.8,-1.54; 103 9.4,1.54; 104 9.4,-1.54; 105 9,1.54; 106 9,-1.54; 107 8.6,1.54; 108 8.6,-1.54; 109 8.2,1.54; 110 8.2,-1.54; 111 7.8,1.54; 112 7.8,-1.54; 113 7.4,1.54; 114 7.4,-1.54; 115 7,1.54; 116 7,-1.54; 117 6.6,1.54; 118 6.6,-1.54; 119 6.2,1.54; 120 6.2,-1.54; 121 5.8,1.54; 122 5.8,-1.54; 123 5.4,1.54; 124 5.4,-1.54; 125 5,1.54; 126 5,-1.54; 127 4.6,1.54; 128 4.6,-1.54; 129 4.2,1.54; 130 4.2,-1.54; 131 3.8,1.54; 132 3.8,-1.54; 133 3.4,1.54; 134 3.4,-1.54; 135 3,1.54; 136 3,-1.54; 137 2.6,1.54; 138 2.6,-1.54; 139 2.2,1.54; 140 2.2,-1.54; 141 1.8,1.54; 142 1.8,-1.54; 143 1.4,1.54; 144 1.4,-1.54; 145 1,1.54; 146 1,-1.54; 147 0.6,1.54; 148 0.6,-1.54; 149 0.2,1.54; 150 0.2,-1.54; 151 -0.2,1.54; 152 -0.2,-1.54; 153 -0.6,1.54; 154 -0.6,-1.54; 155 -1,1.54; 156 -1,-1.54; 157 -1.4,1.54; 158 -1.4,-1.54; 159 -1.8,1.54; 160 -1.8,-1.54; 161 -2.2,1.54; 162 -2.2,-1.54; 163 -2.6,1.54; 164 -2.6,-1.54; 165 -3,1.54; 166 -3,-1.54; 167 -3.4,1.54; 168 -3.4,-1.54; 169 -3.8,1.54; 170 -3.8,-1.54; 171 -4.2,1.54; 172 -4.2,-1.54; 173 -4.6,1.54; 174 -4.6,-1.54; 175 -5,1.54; 176 -5,-1.54; 177 -5.4,1.54; 178 -5.4,-1.54; 179 -5.8,1.54; 180 -5.8,-1.54; 181 -6.2,1.54; 182 -6.2,-1.54; 183 -6.6,1.54; 184 -6.6,-1.54; 185 -7,1.54; 186 -7,-1.54; 187 -7.4,1.54; 188 -7.4,-1.54; 189 -7.8,1.54; 190 -7.8,-1.54; 191 -8.2,1.54; 192 -8.2,-1.54; 193 -8.6,1.54; 194 -8.6,-1.54; 195 -9,1.54; 196 -9,-1.54; 197 -9.4,1.54; 198 -9.4,-1.54; 199 -9.8,1.54; 200 -9.8,-1.54 | hole 2.7: -21.5,33.5; 26.5,33.5; -21.5,0.5; 26.5,0.5

### Placement (x,y rotation side)
U$1  25,3 0 top
U$2  25,3 0 top
U$3  [DIODES-DELIGHT-LOGO-15X15-BTM]  34.33,13.92 0 bottom

### Tracks (layer width: path | path; a pad name or v marks a point on that pad's centre or on a via)
1.8V-OUT  (via drill 0.2)
  Top 0.203: v17.44,34.73 17.6,34.88 U$2.88 17.54,35.54 17.22,35.54 U$2.90 17.2,36.15 v17.38,36.33
  Bottom 0.203: U$1.90 17.22,35.7 17.54,35.7 U$1.88 17.6,34.88 v17.44,34.73
3.3V-OUT  (via drill 0.2)
  Top 0.203: 18.01,35.54 18.33,35.54 U$2.84 18.39,34.9 v18.59,34.7 | 18.01,35.54 U$2.86 | v18.03,34.7 18.01,34.7 18.01,35.54
  Bottom 0.203: v18.59,34.7 18.39,34.9 U$1.84 18.33,35.7 18.01,35.7 U$1.86 18.01,34.73 v18.03,34.7
5V-IN  (via drill 0.2)
  Top 0.203: U$2.79 19.28,38.56 19.6,38.56 U$2.77 19.6,39.14 v19.72,39.27 | 18.01,38.56 17.7,38.56 U$2.87 17.58,38.55 v17.58,39.27 | 18.01,38.56 U$2.85 | 18.81,38.56 18.49,38.56 U$2.83 | 18.81,38.56 U$2.81 | 18.01,38.56 18.33,38.56 U$2.83 | 18.01,38.56 U$2.85 | 18.81,38.56 19.13,38.56 U$2.79 | 18.81,38.56 U$2.81 | U$2.85 18,39.16 v18.1,39.27 | U$2.83 18.4,39.02 v18.64,39.27 | U$2.81 18.8,38.88 v19.18,39.27 | U$2.79 19.2,37.69 v19.28,37.61
  Bottom 0.203: U$1.79 19.28,38.4 19.6,38.4 U$1.77 19.6,39.14 v19.72,39.27 | 18.01,38.4 17.7,38.4 U$1.87 17.6,39.25 v17.58,39.27 | 18.01,38.4 U$1.85 | 18.81,38.4 18.49,38.4 U$1.83 | 18.81,38.4 U$1.81 | 18.01,38.4 18.33,38.4 U$1.83 | 18.01,38.4 U$1.85 | 18.81,38.4 19.13,38.4 U$1.79 | 18.81,38.4 U$1.81 | v19.28,37.61 19.2,37.69 U$1.79 | U$1.85 18,39.16 v18.1,39.27 | U$1.83 18.4,39.02 v18.64,39.27 | U$1.81 18.8,38.88 v19.18,39.27
!(1G/10M)ETH_LED1  (via drill 0.2)
  Top 0.203: v31.03,37.61 31.14,37.72 31.15,37.72 31.19,37.76 31.19,38.4 U$2.19
  Bottom 0.203: U$1.19 31.2,37.78 v31.03,37.61
!(1G/100M)ETH_LED2  (via drill 0.2)
  Top 0.203: v31.67,37.61 31.58,37.7 31.58,38.52 U$2.17
  Bottom 0.203: U$1.17 31.58,38.32 31.58,37.7 v31.67,37.61
!(ACT)ETH_LED3  (via drill 0.2)
  Top 0.203: v31.98,39.35 32.01,39.33 32.01,38.56 32,38.55 U$2.15
  Bottom 0.203: v31.98,39.35 31.98,38.4 U$1.15
!BT_DISABLE  (via drill 0.2)
  Top 0.203: v16.78,37.59 16.8,37.62 16.8,37.84 U$2.91
  Bottom 0.203: v16.78,37.59 16.8,37.62 U$1.91
!EEPROM_WP  (via drill 0.2)
  Top 0.203: U$2.20 31.2,34.76 v31.19,34.75
  Bottom 0.203: v31.19,34.75 31.19,35.54 U$1.20
!EXTRST  (via drill 0.2)
  Top 0.203: v15.21,34.7 15.16,34.76 15.16,35.39 U$2.100
  Bottom 0.203: v15.21,34.7 15.16,34.76 15.16,35.54 U$1.100
!PCIE_CLK_REQ  (via drill 0.2)
  Top 0.203: v34.82,2.31 34.82,1.5 U$2.102
  Bottom 0.203: v34.82,2.31 34.82,1.68 U$1.102
!PCIE_RST  (via drill 0.2)
  Top 0.203: U$2.109 33.2,5.28 v33.1,5.38
  Bottom 0.203: v33.1,5.38 33.2,5.28 U$1.109
!PI_LED_ACTIVITY  (via drill 0.2)
  Top 0.203: v30.87,39.35 30.8,39.28 U$2.21
  Bottom 0.203: v30.87,39.35 30.8,39.28 U$1.21
!PWR_LED  (via drill 0.2)
  Top 0.203: v16.11,37.61 16.01,37.71 U$2.95
  Bottom 0.203: v16.11,37.61 16.01,37.71 U$1.95
!RPIBOOT  (via drill 0.2)
  Top 0.203: v16.43,39.35 16.43,38.56 U$2.93
  Bottom 0.203: v16.43,39.35 16.43,38.4 U$1.93
!WL_DISABLE  (via drill 0.2)
  Top 0.203: v17.54,37.61 17.2,37.94 U$2.89 17.22,38.56 U$2.89
  Bottom 0.203: v17.54,37.61 17.22,37.93 17.22,38.24 U$1.89
(1.8V)SYNC_IN  (via drill 0.2)
  Top 0.203: v31.98,36.34 31.98,35.54 U$2.16
  Bottom 0.203: v31.98,36.34 31.98,35.7 U$1.16
(1.8V)SYNC_OUT  (via drill 0.2)
  Top 0.203: v31.83,34.75 31.61,34.97 U$2.18
  Bottom 0.203: v31.83,34.75 31.83,34.76 31.6,34.98 U$1.18
AIN0  (via drill 0.2)
  Top 0.203: v15.95,34.75 15.95,35.39 U$2.96
  Bottom 0.203: v15.95,34.75 15.95,35.54 U$1.96
AIN1  (via drill 0.2)
  Top 0.203: v16.43,36.34 16.43,35.54 U$2.94
  Bottom 0.203: v16.43,36.34 16.43,35.7 U$1.94
CAM0_C_N  (via drill 0.2)
  Top 0.203: v27.22,2.37 27.2,2.34 U$2.140
  Bottom 0.203: v27.22,2.37 27.2,2.34 U$1.140
CAM0_C_P  (via drill 0.2)
  Top 0.203: v26.9,0.62 26.8,0.73 U$2.142
  Bottom 0.203: v26.9,0.62 26.8,0.72 U$1.142
CAM0_D0_N  (via drill 0.2)
  Top 0.203: v29.74,2.34 29.6,2.21 29.6,1.57 U$2.128
  Bottom 0.203: v29.74,2.34 29.6,2.21 29.6,1.73 U$1.128
CAM0_D0_P  (via drill 0.2)
  Top 0.203: U$2.130 29.2,2.29 v29.13,2.37
  Bottom 0.203: v29.13,2.37 29.2,2.29 U$1.130
CAM0_D1_N  (via drill 0.2)
  Top 0.203: v28.44,2.32 28.4,2.28 U$2.134
  Bottom 0.203: v28.44,2.32 28.39,2.27 U$1.134
CAM0_D1_P  (via drill 0.2)
  Top 0.203: v27.84,2.31 28,2.15 U$2.136
  Bottom 0.203: v27.84,2.31 27.99,2.16 U$1.136
CAM1_C_N  (via drill 0.2)
  Top 0.203: v29.76,3.63 29.61,3.79 29.61,4.26 29.6,4.27 29.6,4.43 U$2.127
  Bottom 0.203: v29.76,3.63 29.6,3.79 29.6,4.27 U$1.127
CAM1_C_P  (via drill 0.2)
  Top 0.203: U$2.129 29.2,3.69 v29.15,3.63
  Bottom 0.203: v29.15,3.63 29.2,3.69 U$1.129
CAM1_D0_N  (via drill 0.2)
  Top 0.203: v31.98,5.38 v32,5.37 U$2.115
  Bottom 0.203: v31.98,5.38 31.98,4.43 U$1.115
CAM1_D0_P  (via drill 0.2)
  Top 0.203: U$2.117 31.61,3.74 v31.51,3.63
  Bottom 0.203: v31.51,3.63 31.61,3.74 31.61,4.34 U$1.117
CAM1_D1_N  (via drill 0.2)
  Top 0.203: v30.95,5.27 30.82,5.14 30.82,4.56 U$2.121
  Bottom 0.203: v30.95,5.27 30.82,5.14 30.82,4.38 U$1.121
CAM1_D1_P  (via drill 0.2)
  Top 0.203: U$2.123 30.4,5.24 v30.35,5.29
  Bottom 0.203: v30.35,5.29 30.4,5.24 U$1.123
CAM1_D2_N  (via drill 0.2)
  Top 0.203: v28.49,5.38 28.4,5.29 U$2.133
  Bottom 0.203: v28.49,5.38 28.4,5.29 U$1.133
CAM1_D2_P  (via drill 0.2)
  Top 0.203: U$2.135 28,5.28 v27.89,5.39
  Bottom 0.203: U$1.135 27.99,5.29 v27.89,5.39
CAM1_D3_N  (via drill 0.2)
  Top 0.203: v27.3,3.63 27.2,3.73 U$2.139
  Bottom 0.203: v27.3,3.63 27.2,3.73 U$1.139
CAM1_D3_P  (via drill 0.2)
  Top 0.203: U$2.141 26.8,3.73 v26.69,3.63
  Bottom 0.203: U$1.141 26.8,3.73 v26.69,3.63
CAMERA_GPIO  (via drill 0.2)
  Top 0.203: v15.63,39.35 15.61,39.33 U$2.97
  Bottom 0.203: v15.63,39.35 15.6,39.32 15.6,39.3 U$1.97
DSI0_C_N  (via drill 0.2)
  Top 0.203: v21.19,5.38 21.19,4.59 U$2.169
  Bottom 0.203: v21.19,5.38 21.19,4.43 U$1.169
DSI0_C_P  (via drill 0.2)
  Top 0.203: v20.79,3.61 20.79,4.53 U$2.171
  Bottom 0.203: v20.79,3.61 20.81,3.63 20.81,4.34 U$1.171
DSI0_D0_N  (via drill 0.2)
  Top 0.203: U$2.157 23.6,3.76 v23.73,3.63
  Bottom 0.203: U$1.157 23.62,4.33 23.62,3.74 v23.73,3.63
DSI0_D0_P  (via drill 0.2)
  Top 0.203: v23.09,3.63 23.09,3.66 23.2,3.76 U$2.159
  Bottom 0.203: v23.09,3.63 23.09,3.71 23.2,3.8 U$1.159
DSI0_D1_N  (via drill 0.2)
  Top 0.203: v22.3,5.38 22.38,5.3 22.38,4.56 U$2.163
  Bottom 0.203: v22.3,5.38 22.4,5.28 U$1.163
DSI0_D1_P  (via drill 0.2)
  Top 0.203: v21.98,3.63 22.01,3.66 U$2.165
  Bottom 0.203: U$1.165 22.01,4.35 22.01,3.66 v21.98,3.63
DSI1_C_N  (via drill 0.2)
  Top 0.203: U$2.187 17.6,5.28 v17.7,5.38
  Bottom 0.203: v17.7,5.38 17.6,5.28 U$1.187
DSI1_C_P  (via drill 0.2)
  Top 0.203: v17.22,3.63 17.22,4.43 U$2.189
  Bottom 0.203: v17.22,3.63 17.22,4.27 U$1.189
DSI1_D0_N  (via drill 0.2)
  Top 0.203: v20,5.3 U$2.175
  Bottom 0.203: v20,5.3 U$1.175
DSI1_D0_P  (via drill 0.2)
  Top 0.203: v19.61,3.63 19.61,4.26 19.6,4.27 19.6,4.43 U$2.177
  Bottom 0.203: v19.61,3.63 v19.6,3.64 19.6,4.27 U$1.177
DSI1_D1_N  (via drill 0.2)
  Top 0.203: v18.97,3.63 18.81,3.79 18.81,4.43 U$2.181
  Bottom 0.203: v18.97,3.63 18.81,3.79 18.81,4.27 U$1.181
DSI1_D1_P  (via drill 0.2)
  Top 0.203: v18.33,3.63 18.41,3.71 U$2.183
  Bottom 0.203: U$1.183 18.41,4.35 18.41,3.71 v18.33,3.63
DSI1_D2_N  (via drill 0.2)
  Top 0.203: v16.43,5.38 16.43,4.59 U$2.193
  Bottom 0.203: v16.43,5.38 16.43,4.43 U$1.193
DSI1_D2_P  (via drill 0.2)
  Top 0.203: v15.95,3.63 16,3.69 U$2.195
  Bottom 0.203: v15.95,3.63 16,3.69 U$1.195
DSI1_D3_N  (via drill 0.2)
  Top 0.203: U$2.194 16.4,2.29 v16.45,2.35
  Bottom 0.203: U$1.194 16.4,2.29 v16.45,2.35
DSI1_D3_P  (via drill 0.2)
  Top 0.203: U$2.196 16,2.19 v15.85,2.34
  Bottom 0.203: v15.85,2.34 16,2.19 U$1.196
GLOBAL_EN  (via drill 0.2)
  Top 0.203: v15.16,37.61 15.21,37.66 U$2.99
  Bottom 0.203: U$1.99 15.21,37.66 v15.16,37.61
GND  (via drill 0.2)
  Top 0.152: U$2.191 16.8,5.14 16.86,5.2 v16.86,6.11 v16.87,6.12 | U$2.197 15.6,5.15 15.61,5.16 15.61,5.86 v15.87,6.12 | U$2.179 19.2,5.79 v18.87,6.12 | v21.62,3.03 21.62,3.38 21.55,3.46 21.55,3.81 21.6,3.86 U$2.167 | U$2.162 22.8,0.73 v22.97,0.56 | U$2.156 24,0.97 v23.59,0.56 | U$2.150 v25.2,0.57 v25.21,0.56 | U$2.144 26.4,1.01 v25.95,0.56 | U$2.126 30,0.65 v29.89,0.54 | U$2.132 28.8,0.63 v28.89,0.54 | U$2.138 27.6,0.83 v27.89,0.54 | U$2.120 31.2,0.85 v30.89,0.54 | U$2.114 32.4,1.03 v32.89,0.54 | U$2.108 33.6,0.83 v33.89,0.54 | U$2.125 30,4.01 30.2,3.81 30.2,3.46 30.18,3.44 v30.18,3.05 | U$2.113 32.4,5.18 32.42,5.2 32.42,5.67 v32.87,6.12 | U$2.42 26.8,36.1 26.86,36.16 26.86,36.52 26.85,36.53 v26.85,36.97 | U$2.186 18,1.04 v17.56,0.6 | U$2.66 21.98,35.48 21.98,35.92 21.78,36.11 21.78,36.91 v21.85,36.97 | U$2.137 27.61,4.07 28.17,3.5 v28.17,3.03 | U$2.119 31.2,3.94 31.08,3.81 31.08,3.36 v30.79,3.08 | U$2.131 28.8,4.91 v29.34,5.45 | U$2.59 23.2,37.87 v23.42,37.65 | U$2.43 26.4,37.87 26.31,37.79 26.31,37.27 v26.01,36.97 | U$2.32 28.8,36.03 28.93,36.16 28.93,36.55 v29.34,36.97 | U$2.180 19.21,1.03 19.54,0.69 v19.54,0.66 | U$2.185 18,4.03 17.65,3.68 17.65,3.46 17.46,3.26 v17.46,3.05
  Bottom 0.152: U$1.125 30,4.01 30.2,3.81 30.26,3.75 30.26,3.13 v30.18,3.05 | U$1.120 31.2,0.85 v30.89,0.54 | U$1.119 31.2,3.94 31.08,3.81 31.08,3.36 v30.79,3.08 | U$1.59 23.2,37.87 v23.42,37.65 | U$1.43 26.4,37.87 26.22,37.7 26.22,37.18 v26.01,36.97 | U$1.32 28.8,36.03 28.93,36.16 28.93,36.55 v29.34,36.97 | U$1.66 22.12,35.52 22.12,34.8 22.42,34.49 v22.42,33.79
  other vias: 35,36.34 15.96,3.03 16.69,3.03 18.17,3.03 18.88,3.03 19.59,3.03 20.22,3.05 20.94,3.03 22.28,3.03 22.94,3.03 23.63,3.03 24.29,3.03 24.92,3.03 25.53,3.03 26.17,3.05 26.83,3.03 27.54,3.03 28.94,3.03 29.6,3.05 31.4,3 32.01,3.03 32.67,3.03 33.28,3.03 33.89,3 34.47,3.03 35.13,3.05 15.35,3.03 14.76,3.03 14.35,36.97 15.19,36.97 16.02,36.97 16.85,36.97 17.68,36.97 18.52,36.97 19.35,36.97 20.18,36.97 21.02,36.97 22.68,36.97 23.51,36.97 24.35,36.97 25.18,36.97 27.68,36.97 28.51,36.97 30.18,36.97 31.01,36.97 31.84,36.97 32.68,36.97 33.51,36.97 34.34,36.97 35.18,36.97 36.01,36.97 15.5,33.78 16.49,33.78 19.46,33.78 21.44,33.78 24.4,33.78 25.39,33.78 27.37,33.78 32.32,33.78 35.29,33.78 34.3,33.78 33.31,33.78 31.33,33.78 30.34,33.78 29.35,33.78 28.36,33.78 17.48,33.78 18.47,33.78 20.45,33.78 23.41,33.78 26.38,33.78 14.51,33.78 14.87,6.12 13.52,36.97 17.87,6.12 19.87,6.12 20.87,6.12 21.87,6.12 22.87,6.12 23.87,6.12 24.87,6.12 25.87,6.12 26.87,6.12 27.9,6.12 28.62,6.11 30.09,5.92 30.97,6.01 31.92,6.06 33.87,6.12 34.87,6.12 35.87,6.12 31.89,0.54 34.89,0.54 21.59,0.58 20.19,0.64 16.87,0.59 15.59,0.6 14.68,1.65 14.79,39.2 21.04,39.3 24.34,39.27 28.43,37.67 30.23,39.3 32.62,39.27 34.8,39.27 35.03,37.57 35.34,4.35 35.34,1.64 14.66,4.38 14.67,35.59 14.67,38.36 35.34,38.37 35.31,35.6
  pour Top: -3.67,45.92 60.33,45.92 60.33,-3.08 -3.67,-3.08
  pour Bottom: -5.67,47.92 62.33,47.92 62.33,-5.08 -5.67,-5.08
  pour Route2: -6.67,48.92 64.33,48.92 64.33,-6.08 -6.67,-6.08
  pour Route15: -7.67,49.92 65.33,49.92 65.33,-7.08 -7.67,-7.08
GPIO2  (via drill 0.2)
  Top 0.203: v23.57,34.75 23.57,35.39 U$2.58
  Bottom 0.203: v23.57,34.75 23.57,35.54 U$1.58
GPIO3  (via drill 0.2)
  Top 0.203: v24.05,36.34 24.05,35.54 U$2.56
  Bottom 0.203: v24.05,36.34 24.05,35.7 U$1.56
GPIO4  (via drill 0.2)
  Top 0.203: v24.38,34.73 24.41,34.76 24.41,34.77 24.4,34.75 U$2.54
  Bottom 0.203: v24.38,34.73 24.4,34.75 U$1.54
GPIO5  (via drill 0.2)
  Top 0.203: v28.49,36.34 28.4,36.25 U$2.34
  Bottom 0.203: v28.49,36.34 28.4,36.25 U$1.34
GPIO6  (via drill 0.2)
  Top 0.203: U$2.30 29.2,34.83 v29.13,34.75
  Bottom 0.203: v29.13,34.75 29.2,34.83 U$1.30
GPIO7  (via drill 0.2)
  Top 0.203: U$2.37 27.6,37.71 v27.7,37.61
  Bottom 0.203: v27.7,37.61 27.6,37.71 U$1.37
GPIO8  (via drill 0.2)
  Top 0.203: v27.22,39.35 27.22,38.56 U$2.39
  Bottom 0.203: v27.22,39.35 27.22,38.4 U$1.39
GPIO9  (via drill 0.2)
  Top 0.203: v27.22,34.75 27.2,34.77 U$2.40
  Bottom 0.203: v27.22,34.75 27.2,34.77 U$1.40
GPIO10  (via drill 0.2)
  Top 0.203: v26.43,36.34 26.43,35.54 U$2.44
  Bottom 0.203: v26.43,36.34 26.43,35.7 U$1.44
GPIO11  (via drill 0.2)
  Top 0.203: v27.54,36.34 27.59,36.29 27.59,35.47 U$2.38
  Bottom 0.203: U$1.38 27.6,36.27 v27.54,36.34
GPIO12  (via drill 0.2)
  Top 0.203: v28.81,39.35 28.81,38.56 U$2.31
  Bottom 0.203: v28.81,39.35 28.81,38.4 U$1.31
GPIO13  (via drill 0.2)
  Top 0.203: v29.76,34.75 29.6,34.91 29.6,35.38 29.6,35.39 U$2.28
  Bottom 0.203: v29.76,34.75 29.6,34.91 29.6,35.54 U$1.28
GPIO14  (via drill 0.2)
  Top 0.203: U$2.55 24,37.66 v24.05,37.61
  Bottom 0.203: v24.05,37.61 24,37.66 U$1.55
GPIO15  (via drill 0.2)
  Top 0.203: U$2.51 24.79,37.66 v24.84,37.61
  Bottom 0.203: v24.84,37.61 24.79,37.66 U$1.51
GPIO16  (via drill 0.2)
  Top 0.203: U$2.29 29.2,37.7 v29.29,37.61
  Bottom 0.203: v29.29,37.61 29.21,37.68 U$1.29
GPIO17  (via drill 0.2)
  Top 0.203: U$2.50 25.21,34.8 v25.16,34.75
  Bottom 0.203: v25.16,34.75 25.21,34.8 U$1.50
GPIO18  (via drill 0.2)
  Top 0.203: U$2.49 25.21,39.3 v25.16,39.35
  Bottom 0.203: v25.16,39.35 25.21,39.3 25.21,38.36 U$1.49
GPIO19  (via drill 0.2)
  Top 0.203: U$2.26 29.99,36.25 v30.08,36.34
  Bottom 0.203: v30.08,36.34 29.99,36.25 29.99,35.64 U$1.26
GPIO20  (via drill 0.2)
  Top 0.203: v29.6,39.35 29.6,38.56 U$2.27
  Bottom 0.203: v29.6,39.35 29.6,38.4 U$1.27
GPIO21  (via drill 0.2)
  Top 0.203: v30.08,37.61 30,37.68 U$2.25
  Bottom 0.203: v30.08,37.61 30,37.68 U$1.25
GPIO22  (via drill 0.2)
  Top 0.203: v26.11,34.75 26,34.86 U$2.46
  Bottom 0.203: U$1.46 26,34.86 v26.11,34.75
GPIO23  (via drill 0.2)
  Top 0.203: U$2.47 25.61,37.63 v25.63,37.61
  Bottom 0.203: v25.63,37.61 25.58,37.66 25.58,38.33 U$1.47
GPIO24  (via drill 0.2)
  Top 0.203: v26.11,39.35 26.01,39.25 26.01,38.73 26,38.73 U$2.45
  Bottom 0.203: v26.11,39.35 25.98,39.23 25.98,38.36 U$1.45
GPIO25  (via drill 0.2)
  Top 0.203: U$2.41 26.81,37.67 v26.75,37.61
  Bottom 0.203: v26.75,37.61 26.8,37.66 U$1.41
GPIO26  (via drill 0.2)
  Top 0.203: v30.56,34.75 30.4,34.9 30.4,35.38 30.4,35.39 U$2.24
  Bottom 0.203: v30.56,34.75 30.4,34.91 30.4,35.54 U$1.24
GPIO27  (via drill 0.2)
  Top 0.203: v25.63,36.34 25.63,35.54 U$2.48
  Bottom 0.203: v25.63,36.34 25.63,35.7 U$1.48
GPIO_VREF  (via drill 0.2)
  Top 0.203: v19.6,36.34 19.6,35.54 U$2.78
  Bottom 0.203: v19.6,36.34 19.6,35.7 U$1.78
HDMI0_CEC  (via drill 0.2)
  Top 0.203: v24.52,5.38 24.52,5.23 24.79,4.96 U$2.151
  Bottom 0.203: U$1.151 24.79,4.99 24.52,5.25 v24.52,5.38
HDMI0_CK_N  (via drill 0.2)
  Top 0.203: v17.06,2.37 17.22,2.21 17.22,1.48 U$2.190
  Bottom 0.203: v17.06,2.37 17.22,2.21 17.22,1.73 U$1.190
HDMI0_CK_P  (via drill 0.2)
  Top 0.203: U$2.188 17.6,2.26 v17.7,2.37
  Bottom 0.203: v17.7,2.37 17.6,2.26 U$1.188
HDMI0_D0_N  (via drill 0.2)
  Top 0.203: U$2.184 18.41,1.44 18.41,0.75 v18.29,0.62
  Bottom 0.203: v18.29,0.62 18.41,0.75 18.41,1.63 U$1.184
HDMI0_D0_P  (via drill 0.2)
  Top 0.203: U$2.182 18.81,0.71 v18.91,0.61
  Bottom 0.203: U$1.182 18.81,1.64 18.81,0.71 v18.91,0.61
HDMI0_D1_N  (via drill 0.2)
  Top 0.203: U$2.178 19.6,2.21 v19.44,2.37
  Bottom 0.203: v19.44,2.37 19.6,2.21 19.6,1.73 U$1.178
HDMI0_D1_P  (via drill 0.2)
  Top 0.203: v20.08,2.37 20,2.29 U$2.176
  Bottom 0.203: U$1.176 20,2.29 v20.08,2.37
HDMI0_D2_N  (via drill 0.2)
  Top 0.203: v20.87,0.62 20.8,0.69 U$2.172
  Bottom 0.203: U$1.172 20.8,0.69 v20.87,0.62
HDMI0_D2_P  (via drill 0.2)
  Top 0.203: v21.19,2.37 21.19,1.57 U$2.170
  Bottom 0.203: v21.19,2.37 21.19,1.73 U$1.170
HDMI0_HOTPLUG  (via drill 0.2)
  Top 0.203: U$2.153 24.4,3.67 v24.36,3.63
  Bottom 0.203: U$1.153 24.4,3.67 v24.36,3.63
HDMI0_SCL  (via drill 0.2)
  Top 0.203: v14.68,0.78 15.2,1.29 U$2.200
  Bottom 0.203: v14.68,0.78 15.2,1.29 15.2,1.64 U$1.200
HDMI0_SDA  (via drill 0.2)
  Top 0.203: U$2.199 15.21,5.31 v15.18,5.34
  Bottom 0.203: v15.18,5.34 15.21,5.31 U$1.199
HDMI1_CEC  (via drill 0.2)
  Top 0.203: U$2.149 25.21,5.33 v25.16,5.38
  Bottom 0.203: v25.16,5.38 25.21,5.33 U$1.149
HDMI1_CK_N  (via drill 0.2)
  Top 0.203: v21.98,2.37 21.98,1.57 U$2.166
  Bottom 0.203: v21.98,2.37 21.98,1.73 U$1.166
HDMI1_CK_P  (via drill 0.2)
  Top 0.203: v22.3,0.62 22.41,0.73 U$2.164
  Bottom 0.203: U$1.164 22.43,1.62 22.43,0.75 v22.3,0.62
HDMI1_D0_N  (via drill 0.2)
  Top 0.203: 23.2,2.31 23.15,2.37 v23.09,2.37 | 23.2,2.31 | 23.2,2.31 U$2.160
  Bottom 0.203: v23.09,2.37 23.2,2.26 U$1.160
HDMI1_D0_P  (via drill 0.2)
  Top 0.203: v23.73,2.37 23.6,2.24 23.6,1.6 23.6,1.58 U$2.158
  Bottom 0.203: v23.73,2.37 23.6,2.23 U$1.158
HDMI1_D1_N  (via drill 0.2)
  Top 0.203: U$2.154 24.4,0.66 v24.36,0.62
  Bottom 0.203: v24.36,0.62 24.4,0.66 U$1.154
HDMI1_D1_P  (via drill 0.2)
  Top 0.203: v24.68,2.37 24.8,2.25 U$2.152
  Bottom 0.203: U$1.152 24.8,2.24 v24.68,2.37
HDMI1_D2_N  (via drill 0.2)
  Top 0.203: v25.48,2.37 25.6,2.24 25.6,1.63 25.6,1.62 U$2.148
  Bottom 0.203: v25.48,2.37 25.61,2.23 25.61,1.67 U$1.148
HDMI1_D2_P  (via drill 0.2)
  Top 0.203: U$2.146 26,2.25 v26.11,2.37
  Bottom 0.203: v26.11,2.37 v26.1,2.37 26,2.29 U$1.146
HDMI1_HOTPLUG  (via drill 0.2)
  Top 0.203: U$2.143 26.4,5.16 v26.61,5.36
  Bottom 0.203: v26.61,5.36 26.4,5.16 U$1.143
HDMI1_SCL  (via drill 0.2)
  Top 0.203: v25.63,3.63 25.61,3.66 25.61,4.51 U$2.147
  Bottom 0.203: v25.63,3.63 25.58,3.69 25.58,4.34 U$1.147
HDMI1_SDA  (via drill 0.2)
  Top 0.203: U$2.145 26,5.28 v25.93,5.36
  Bottom 0.203: v25.93,5.36 26,5.28 U$1.145
ID_SC  (via drill 0.2)
  Top 0.203: v28.02,39.35 28.02,38.56 U$2.35
  Bottom 0.203: v28.02,39.35 28.02,38.4 U$1.35
ID_SD  (via drill 0.2)
  Top 0.203: U$2.36 28.02,35.44 v28.02,34.75
  Bottom 0.203: v28.02,34.75 28.02,35.54 U$1.36
PCIE_CLK_N  (via drill 0.2)
  Top 0.203: v32.78,2.37 32.8,2.34 U$2.112
  Bottom 0.203: U$1.112 32.8,2.34 v32.78,2.37
PCIE_CLK_P  (via drill 0.2)
  Top 0.203: v33.38,2.35 33.38,2.27 33.2,2.09 U$2.110
  Bottom 0.203: v33.38,2.35 33.38,2.26 33.2,2.08 U$1.110
PCIE_RX_N  (via drill 0.2)
  Top 0.203: v31.59,2.4 31.59,1.48 U$2.118
  Bottom 0.203: v31.59,2.4 31.59,1.66 U$1.118
PCIE_RX_P  (via drill 0.2)
  Top 0.203: v32.19,2.34 32.01,2.16 U$2.116
  Bottom 0.203: U$1.116 32.01,2.16 v32.19,2.34
PCIE_TX_N  (via drill 0.2)
  Top 0.203: U$2.124 30.4,1.51 30.4,2.32 v30.35,2.37
  Bottom 0.203: U$1.124 30.4,2.32 v30.35,2.37
PCIE_TX_P  (via drill 0.2)
  Top 0.203: U$2.122 30.8,2.19 v30.98,2.37
  Bottom 0.203: v30.98,2.37 30.8,2.19 U$1.122
RUN_PG  (via drill 0.2)
  Top 0.203: v16.78,34.75 16.78,34.77 16.8,34.8 U$2.92
  Bottom 0.203: U$1.92 16.78,35.61 v16.78,34.75
SCL0  (via drill 0.2)
  Top 0.203: v19.28,34.75 19.2,34.83 U$2.80
  Bottom 0.203: v19.28,34.75 19.2,34.83 U$1.80
SD_CLK  (via drill 0.2)
  Top 0.203: v23.57,39.35 23.57,38.56 U$2.57
  Bottom 0.203: v23.57,39.35 23.57,38.4 U$1.57
SD_CMD  (via drill 0.2)
  Top 0.203: U$2.62 22.81,34.78 v22.78,34.75
  Bottom 0.203: v22.78,34.75 22.82,34.79 22.82,35.62 U$1.62
SD_DAT0  (via drill 0.2)
  Top 0.203: U$2.63 22.38,38.56 22.38,39.28 v22.46,39.35
  Bottom 0.203: v22.46,39.35 22.38,39.28 22.38,38.36 U$1.63
SD_DAT1  (via drill 0.2)
  Top 0.203: U$2.67 21.59,39.28 v21.67,39.35
  Bottom 0.203: v21.67,39.35 21.59,39.28 21.59,38.36 U$1.67
SD_DAT2  (via drill 0.2)
  Top 0.203: v21.19,37.61 21.19,38.4 U$2.69
  Bottom 0.203: v21.19,37.61 21.19,38.24 U$1.69
SD_DAT3  (via drill 0.2)
  Top 0.203: U$2.61 22.8,37.63 v22.78,37.61
  Bottom 0.203: v22.78,37.61 22.8,37.63 U$1.61
SD_DAT4  (via drill 0.2)
  Top 0.203: v21.67,34.75 21.6,34.81 U$2.68
  Bottom 0.203: v21.67,34.75 21.59,34.83 U$1.68
SD_DAT5  (via drill 0.2)
  Top 0.203: v22.3,36.34 22.39,36.25 U$2.64
  Bottom 0.203: U$1.64 22.4,36.24 v22.3,36.34
SD_DAT6  (via drill 0.2)
  Top 0.203: v20.71,34.75 20.79,34.83 20.79,35.33 20.8,35.32 U$2.72
  Bottom 0.203: U$1.72 20.81,35.62 20.81,34.85 v20.71,34.75
SD_DAT7  (via drill 0.2)
  Top 0.203: v21.19,36.34 21.19,35.54 U$2.70
  Bottom 0.203: v21.19,36.34 21.19,35.7 U$1.70
SD_PWR_ON  (via drill 0.2)
  Top 0.203: U$2.75 20,37.69 v20.08,37.61
  Bottom 0.203: U$1.75 20,37.69 v20.08,37.61
SD_VDD_OVERRIDE  (via drill 0.2)
  Top 0.203: v20.4,39.35 20.4,38.56 U$2.73
  Bottom 0.203: v20.4,39.35 20.4,38.4 U$1.73
SDA0  (via drill 0.2)
  Top 0.203: v18.82,36.34 18.81,36.33 18.81,35.54 U$2.82
  Bottom 0.203: v18.82,36.34 18.81,36.33 18.81,35.7 U$1.82
TRD0_N  (via drill 0.2)
  Top 0.203: v33.25,34.75 33.25,35.39 U$2.10
  Bottom 0.203: v33.25,34.75 33.25,35.54 U$1.10
TRD0_P  (via drill 0.2)
  Top 0.203: v32.78,36.34 32.78,35.54 U$2.12
  Bottom 0.203: v32.78,36.34 32.78,35.7 U$1.12
TRD1_N  (via drill 0.2)
  Top 0.203: U$2.6 34,34.83 33.92,34.75 v33.89,34.75
  Bottom 0.203: U$1.6 34,34.86 v33.89,34.75
TRD1_P  (via drill 0.2)
  Top 0.203: U$2.4 34.4,34.88 v34.52,34.75
  Bottom 0.203: U$1.4 34.4,34.87 v34.52,34.75
TRD2_N  (via drill 0.2)
  Top 0.203: v33.25,39.35 33.2,39.3 U$2.9
  Bottom 0.203: v33.25,39.35 33.2,39.3 U$1.9
TRD2_P  (via drill 0.2)
  Top 0.203: v32.78,37.61 32.78,38.4 U$2.11
  Bottom 0.203: v32.78,37.61 32.78,38.24 U$1.11
TRD3_N  (via drill 0.2)
  Top 0.203: v33.89,39.35 33.99,39.25 33.99,38.69 34,38.7 U$2.5
  Bottom 0.203: v33.89,39.35 34,39.24 U$1.5
TRD3_P  (via drill 0.2)
  Top 0.203: U$2.3 34.4,37.65 v34.37,37.61
  Bottom 0.203: v34.37,37.61 34.4,37.65 U$1.3
TV_OUT  (via drill 0.2)
  Top 0.203: U$2.111 32.8,3.66 v32.78,3.63
  Bottom 0.203: v32.78,3.63 32.8,3.66 U$1.111
USB2_N  (via drill 0.2)
  Top 0.203: v34.37,3.63 34.39,3.66 34.39,4.51 U$2.103
  Bottom 0.203: U$1.103 34.39,4.35 34.39,3.66 v34.37,3.63
USB2_P  (via drill 0.2)
  Top 0.203: U$2.105 34,5.27 v33.89,5.38
  Bottom 0.203: v33.89,5.38 33.99,5.28 U$1.105
USBOTG_ID  (via drill 0.2)
  Top 0.203: U$2.101 34.8,5.34 v34.84,5.38
  Bottom 0.203: v34.84,5.38 34.79,5.33 34.79,4.43 34.8,4.42 U$1.101